# Altium project WiWi_SDR.PrjPcb (part 4 of 5)

## Sheet 14-DPLL_1.SchDoc
size C; SheetNumber: 14; SheetTotal: 19
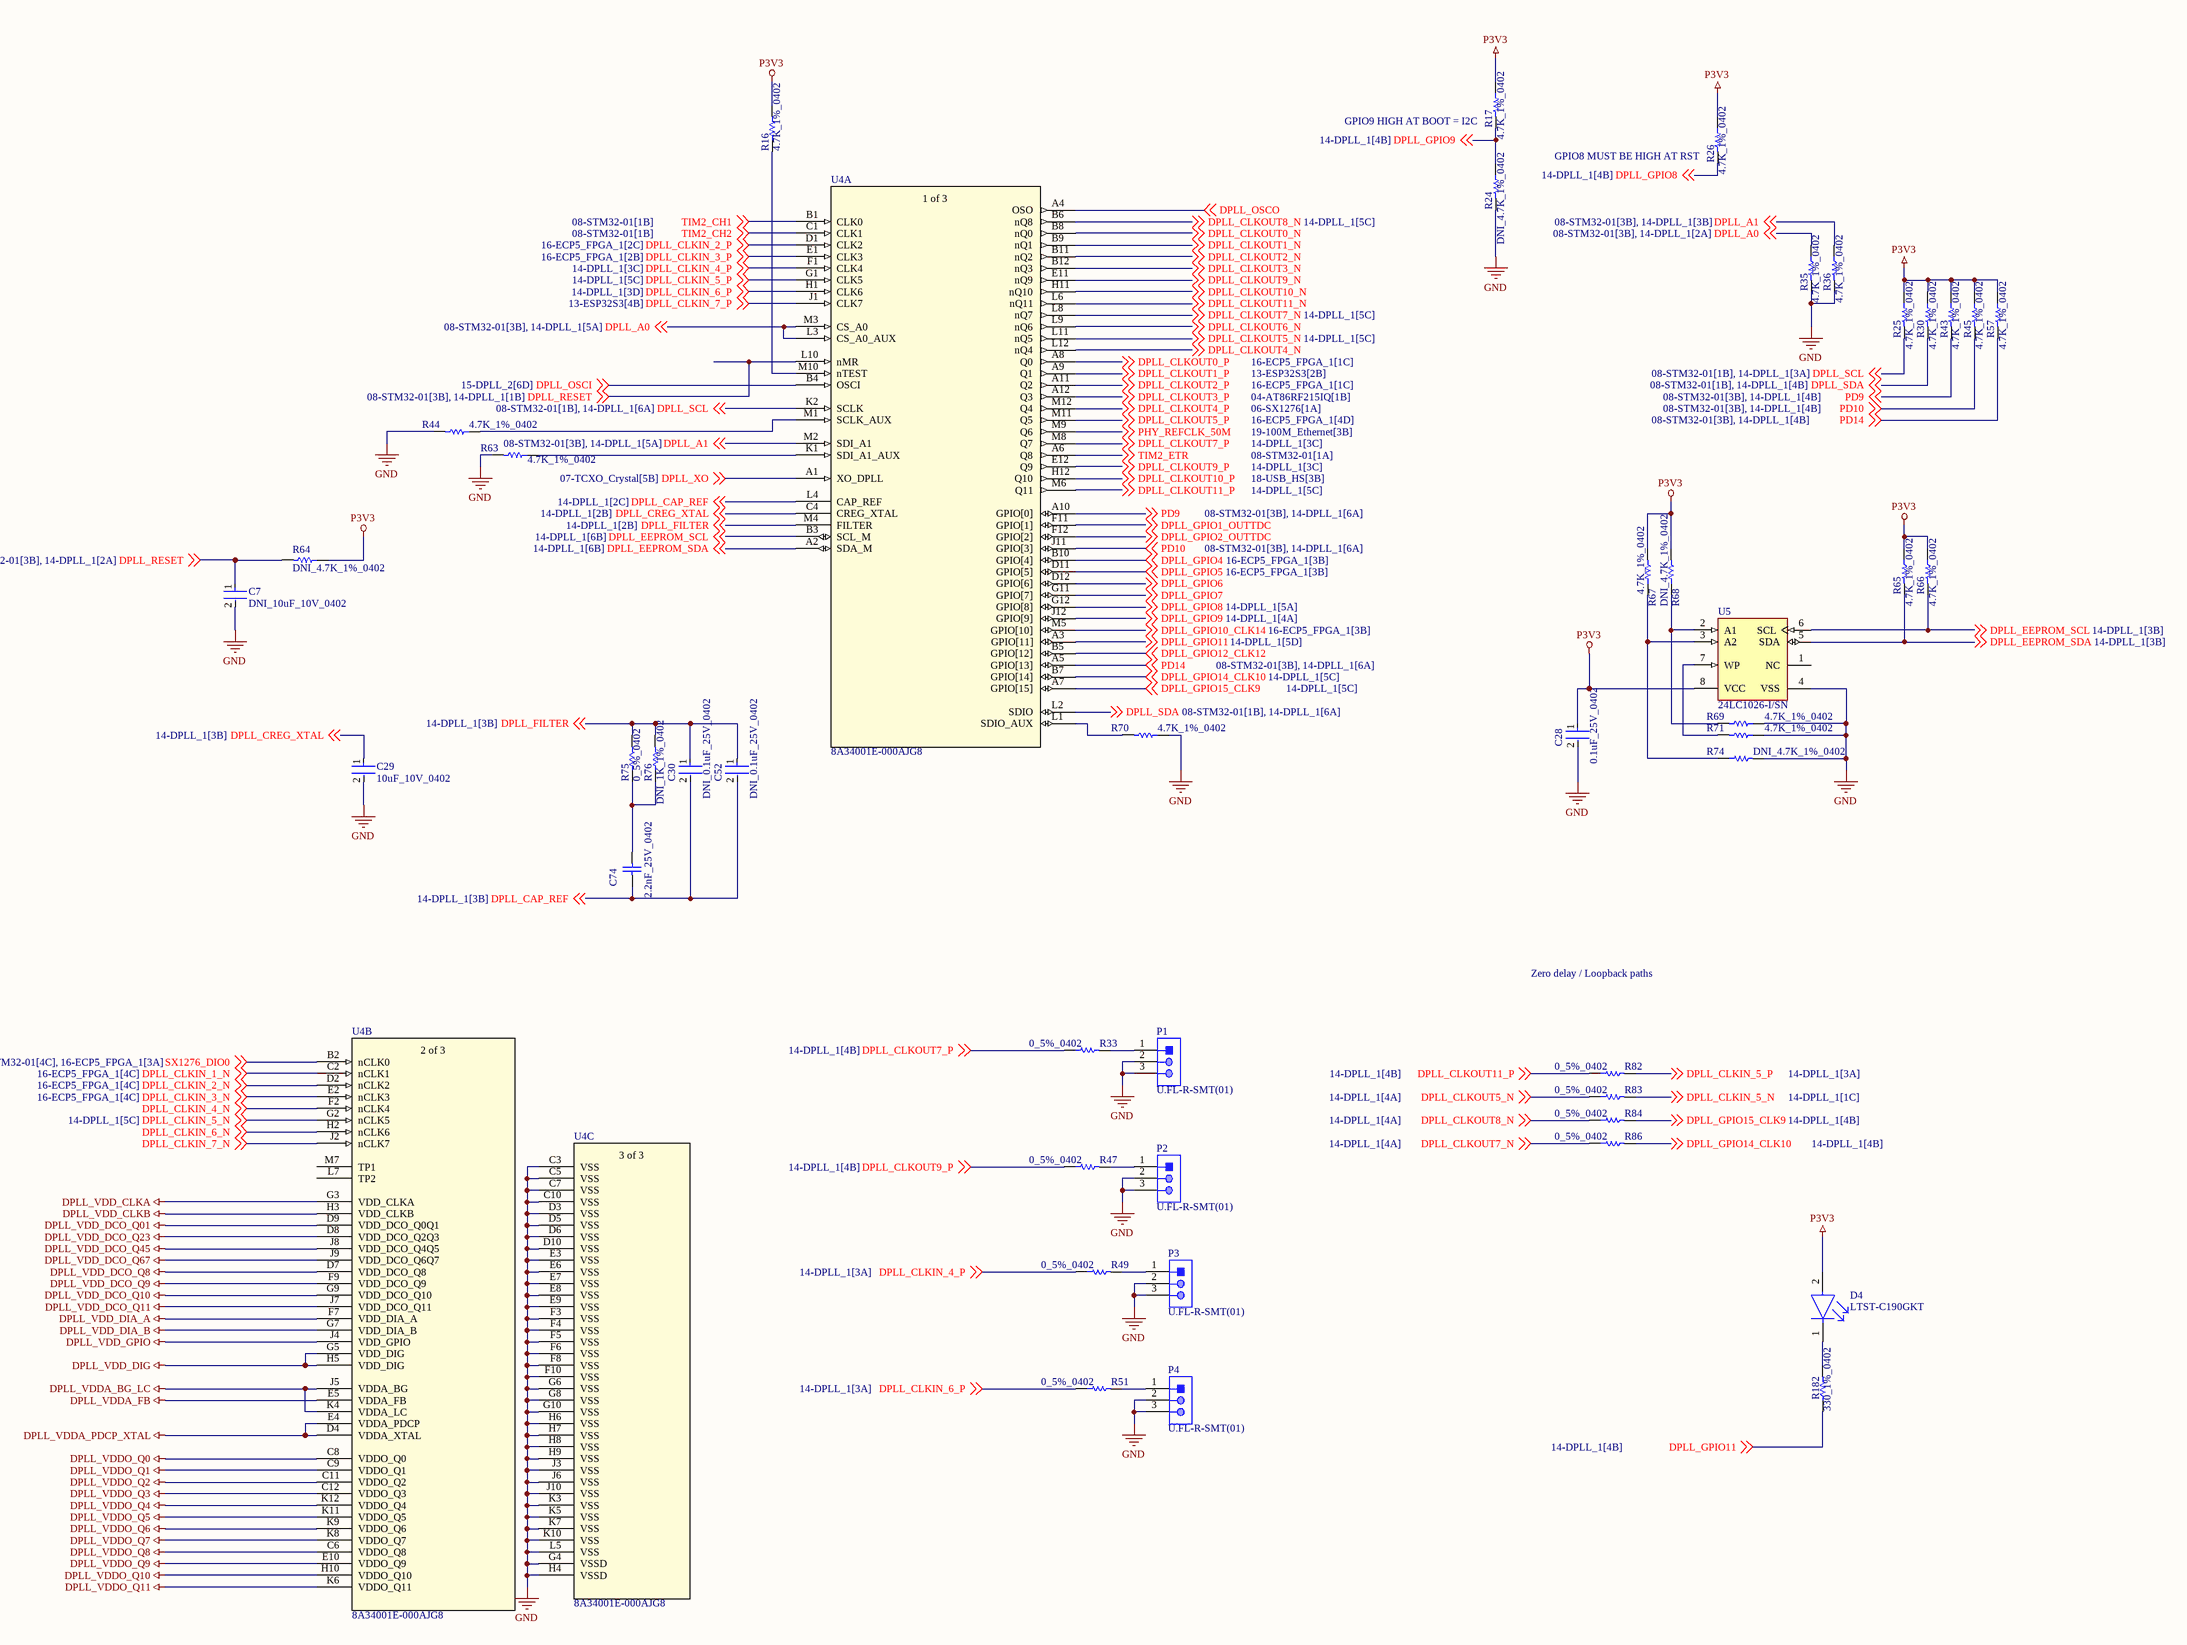
[diagram p11: 14-DPLL_1.SchDoc]

### Parts
C7  DNI_10uF_10V_0402  [FP-CL05A106MP5NUNC-MFG]  (no BOM)
C28  0.1uF_25V_0402  [FP-0402-L_1_0_1-W_0_5_0_1-IPC_C]
C29  10uF_10V_0402  [FP-CL05A106MP5NUNC-MFG]
C30  DNI_0.1uF_25V_0402  [FP-0402-L_1_0_1-W_0_5_0_1-IPC_C]  (no BOM)
C52  DNI_0.1uF_25V_0402  [FP-0402-L_1_0_1-W_0_5_0_1-IPC_C]  (no BOM)
C74  2.2nF_25V_0402  [CAPC1005X56X25LL10T15]
D4  LTST-C190GKT  [FP-LTST-C190GKT-MFG]
P1  U.FL-R-SMT(01)  [HRS-U.FL-R-SMT(10)_V]
P2  U.FL-R-SMT(01)  [HRS-U.FL-R-SMT(10)_V]
P3  U.FL-R-SMT(01)  [HRS-U.FL-R-SMT(10)_V]
P4  U.FL-R-SMT(01)  [HRS-U.FL-R-SMT(10)_V]
R16  4.7K_1%_0402  [RESC1005X40X25NL10T10]
R17  4.7K_1%_0402  [RESC1005X40X25NL10T10]
R24  DNI_4.7K_1%_0402  [RESC1005X40X25NL10T10]  (no BOM)
R25  4.7K_1%_0402  [RESC1005X40X25NL10T10]
R26  4.7K_1%_0402  [RESC1005X40X25NL10T10]
R30  4.7K_1%_0402  [RESC1005X40X25NL10T10]
R33  0_5%_0402  [RESC1005X40X25LL10T10]
R35  4.7K_1%_0402  [RESC1005X40X25NL10T10]
R36  4.7K_1%_0402  [RESC1005X40X25NL10T10]
R43  4.7K_1%_0402  [RESC1005X40X25NL10T10]
R44  4.7K_1%_0402  [RESC1005X40X25NL10T10]
R45  4.7K_1%_0402  [RESC1005X40X25NL10T10]
R47  0_5%_0402  [RESC1005X40X25LL10T10]
R49  0_5%_0402  [RESC1005X40X25LL10T10]
R51  0_5%_0402  [RESC1005X40X25LL10T10]
R57  4.7K_1%_0402  [RESC1005X40X25NL10T10]
R63  4.7K_1%_0402  [RESC1005X40X25NL10T10]
R64  DNI_4.7K_1%_0402  [RESC1005X40X25NL10T10]  (no BOM)
R65  4.7K_1%_0402  [RESC1005X40X25NL10T10]
R66  4.7K_1%_0402  [RESC1005X40X25NL10T10]
R67  4.7K_1%_0402  [RESC1005X40X25NL10T10]
R68  DNI_4.7K_1%_0402  [RESC1005X40X25NL10T10]  (no BOM)
R69  4.7K_1%_0402  [RESC1005X40X25NL10T10]
R70  4.7K_1%_0402  [RESC1005X40X25NL10T10]
R71  4.7K_1%_0402  [RESC1005X40X25NL10T10]
R74  DNI_4.7K_1%_0402  [RESC1005X40X25NL10T10]  (no BOM)
R75  0_5%_0402  [RESC1005X40X25LL10T10]
R76  DNI_1K_1%_0402  [RESC1005X40X25NL05T05]  (no BOM)
R82  0_5%_0402  [RESC1005X40X25LL10T10]
R83  0_5%_0402  [RESC1005X40X25LL10T10]
R84  0_5%_0402  [RESC1005X40X25LL10T10]
R86  0_5%_0402  [RESC1005X40X25LL10T10]
R182  330_1%_0402  [RESC1005X40X25NL10T10]
U4  8A34001E-000AJG8  [144-CABGA_REN]  (parts A,B,C of 3)
U5  24LC1026-I/SN  [MCHP-SOIC-SN8_N]

### Nets
DPLL_VDD_CLKA: U4.G3(VDD_CLKA)
DPLL_VDD_CLKB: U4.H3(VDD_CLKB)
DPLL_VDD_DCO_Q01: U4.D9(VDD_DCO_Q0Q1)
DPLL_VDD_DCO_Q8: U4.D7(VDD_DCO_Q8)
DPLL_VDD_DCO_Q9: U4.F9(VDD_DCO_Q9)
DPLL_VDD_DCO_Q10: U4.G9(VDD_DCO_Q10)
DPLL_VDD_DCO_Q11: U4.J7(VDD_DCO_Q11)
DPLL_VDD_DCO_Q23: U4.D8(VDD_DCO_Q2Q3)
DPLL_VDD_DCO_Q45: U4.J8(VDD_DCO_Q4Q5)
DPLL_VDD_DCO_Q67: U4.J9(VDD_DCO_Q6Q7)
DPLL_VDD_DIA_A: U4.F7(VDD_DIA_A)
DPLL_VDD_DIA_B: U4.G7(VDD_DIA_B)
DPLL_VDD_DIG: U4.G5(VDD_DIG) U4.H5(VDD_DIG)
DPLL_VDD_GPIO: U4.J4(VDD_GPIO)
DPLL_VDDA_BG_LC: U4.J5(VDDA_BG) U4.K4(VDDA_LC)
DPLL_VDDA_FB: U4.E5(VDDA_FB)
DPLL_VDDA_PDCP_XTAL: U4.D4(VDDA_XTAL) U4.E4(VDDA_PDCP)
DPLL_VDDO_Q0: U4.C8(VDDO_Q0)
DPLL_VDDO_Q1: U4.C9(VDDO_Q1)
DPLL_VDDO_Q2: U4.C11(VDDO_Q2)
DPLL_VDDO_Q3: U4.C12(VDDO_Q3)
DPLL_VDDO_Q4: U4.K12(VDDO_Q4)
DPLL_VDDO_Q5: U4.K11(VDDO_Q5)
DPLL_VDDO_Q6: U4.K9(VDDO_Q6)
DPLL_VDDO_Q7: U4.K8(VDDO_Q7)
DPLL_VDDO_Q8: U4.C6(VDDO_Q8)
DPLL_VDDO_Q9: U4.E10(VDDO_Q9)
DPLL_VDDO_Q10: U4.H10(VDDO_Q10)
DPLL_VDDO_Q11: U4.K6(VDDO_Q11)
GND: C7.2 C28.2 C29.2 P1.2 P1.3 P2.2 P2.3 P3.2 P3.3 P4.2 P4.3 R24.2 R35.2 R36.2 R44.2 R63.2 R69.1 R70.1 R71.1 R74.2 U4.C3(VSS) U4.C5(VSS) U4.C7(VSS) U4.C10(VSS) U4.D3(VSS) U4.D5(VSS) U4.D6(VSS) U4.D10(VSS) U4.E3(VSS) U4.E6(VSS) U4.E7(VSS) U4.E8(VSS) U4.E9(VSS) U4.F3(VSS) U4.F4(VSS) U4.F5(VSS) U4.F6(VSS) U4.F8(VSS) U4.F10(VSS) U4.G4(VSSD) U4.G6(VSS) U4.G8(VSS) U4.G10(VSS) U4.H4(VSSD) U4.H6(VSS) U4.H7(VSS) U4.H8(VSS) U4.H9(VSS) U4.J3(VSS) U4.J6(VSS) U4.J10(VSS) U4.K3(VSS) U4.K5(VSS) U4.K7(VSS) U4.K10(VSS) U4.L5(VSS) U5.4(VSS)
P3V3: C28.1 D4.2(A) R16.2 R17.1 R25.1 R26.1 R30.1 R43.1 R45.1 R57.1 R64.1 R65.1 R66.1 R67.2 R68.2 U5.8(VCC)
DPLL_A0: R35.1 U4.L3(CS_A0_AUX) U4.M3(CS_A0) ; off-sheet DPLL_A0
DPLL_A1: R36.1 U4.M2(SDI_A1) ; off-sheet DPLL_A1
DPLL_CAP_REF: C30.2 C52.2 C74.1 U4.L4(CAP_REF) ; off-sheet DPLL_CAP_REF
DPLL_CLKIN_1_N: U4.C2(nCLK1) ; off-sheet DPLL_CLKIN_1_N
DPLL_CLKIN_2_N: U4.D2(nCLK2) ; off-sheet DPLL_CLKIN_2_N
DPLL_CLKIN_2_P: U4.D1(CLK2) ; off-sheet DPLL_CLKIN_2_P
DPLL_CLKIN_3_N: U4.E2(nCLK3) ; off-sheet DPLL_CLKIN_3_N
DPLL_CLKIN_3_P: U4.E1(CLK3) ; off-sheet DPLL_CLKIN_3_P
DPLL_CLKIN_4_N: U4.F2(nCLK4) ; off-sheet DPLL_CLKIN_4_N
DPLL_CLKIN_4_P: R49.1 U4.F1(CLK4) ; off-sheet DPLL_CLKIN_4_P
DPLL_CLKIN_5_N: R83.2 U4.G2(nCLK5) ; off-sheet DPLL_CLKIN_5_N
DPLL_CLKIN_5_P: R82.2 U4.G1(CLK5) ; off-sheet DPLL_CLKIN_5_P
DPLL_CLKIN_6_N: U4.H2(nCLK6) ; off-sheet DPLL_CLKIN_6_N
DPLL_CLKIN_6_P: R51.1 U4.H1(CLK6) ; off-sheet DPLL_CLKIN_6_P
DPLL_CLKIN_7_N: U4.J2(nCLK7) ; off-sheet DPLL_CLKIN_7_N
DPLL_CLKIN_7_P: U4.J1(CLK7) ; off-sheet DPLL_CLKIN_7_P
DPLL_CLKOUT0_N: U4.B8(nQ0) ; off-sheet DPLL_CLKOUT0_N
DPLL_CLKOUT0_P: U4.A8(Q0) ; off-sheet DPLL_CLKOUT0_P
DPLL_CLKOUT1_N: U4.B9(nQ1) ; off-sheet DPLL_CLKOUT1_N
DPLL_CLKOUT1_P: U4.A9(Q1) ; off-sheet DPLL_CLKOUT1_P
DPLL_CLKOUT2_N: U4.B11(nQ2) ; off-sheet DPLL_CLKOUT2_N
DPLL_CLKOUT2_P: U4.A11(Q2) ; off-sheet DPLL_CLKOUT2_P
DPLL_CLKOUT3_N: U4.B12(nQ3) ; off-sheet DPLL_CLKOUT3_N
DPLL_CLKOUT3_P: U4.A12(Q3) ; off-sheet DPLL_CLKOUT3_P
DPLL_CLKOUT4_N: U4.L12(nQ4) ; off-sheet DPLL_CLKOUT4_N
DPLL_CLKOUT4_P: U4.M12(Q4) ; off-sheet DPLL_CLKOUT4_P
DPLL_CLKOUT5_N: R83.1 U4.L11(nQ5) ; off-sheet DPLL_CLKOUT5_N
DPLL_CLKOUT5_P: U4.M11(Q5) ; off-sheet DPLL_CLKOUT5_P
DPLL_CLKOUT6_N: U4.L9(nQ6) ; off-sheet DPLL_CLKOUT6_N
DPLL_CLKOUT7_N: R86.1 U4.L8(nQ7) ; off-sheet DPLL_CLKOUT7_N
DPLL_CLKOUT7_P: R33.1 U4.M8(Q7) ; off-sheet DPLL_CLKOUT7_P
DPLL_CLKOUT8_N: R84.1 U4.B6(nQ8) ; off-sheet DPLL_CLKOUT8_N
DPLL_CLKOUT9_N: U4.E11(nQ9) ; off-sheet DPLL_CLKOUT9_N
DPLL_CLKOUT9_P: R47.1 U4.E12(Q9) ; off-sheet DPLL_CLKOUT9_P
DPLL_CLKOUT10_N: U4.H11(nQ10) ; off-sheet DPLL_CLKOUT10_N
DPLL_CLKOUT10_P: U4.H12(Q10) ; off-sheet DPLL_CLKOUT10_P
DPLL_CLKOUT11_N: U4.L6(nQ11) ; off-sheet DPLL_CLKOUT11_N
DPLL_CLKOUT11_P: R82.1 U4.M6(Q11) ; off-sheet DPLL_CLKOUT11_P
DPLL_CREG_XTAL: C29.1 U4.C4(CREG_XTAL) ; off-sheet DPLL_CREG_XTAL
DPLL_EEPROM_SCL: R66.2 U4.B3(SCL_M) U5.6(SCL) ; off-sheet DPLL_EEPROM_SCL
DPLL_EEPROM_SDA: R65.2 U4.A2(SDA_M) U5.5(SDA) ; off-sheet DPLL_EEPROM_SDA
DPLL_FILTER: C30.1 C52.1 R75.2 R76.2 U4.M4(FILTER) ; off-sheet DPLL_FILTER
DPLL_GPIO1_OUTTDC: U4.F11(GPIO[1]) ; off-sheet DPLL_GPIO1_OUTTDC
DPLL_GPIO2_OUTTDC: U4.F12(GPIO[2]) ; off-sheet DPLL_GPIO2_OUTTDC
DPLL_GPIO4: U4.B10(GPIO[4]) ; off-sheet DPLL_GPIO4
DPLL_GPIO5: U4.D11(GPIO[5]) ; off-sheet DPLL_GPIO5
DPLL_GPIO6: U4.D12(GPIO[6]) ; off-sheet DPLL_GPIO6
DPLL_GPIO7: U4.G11(GPIO[7]) ; off-sheet DPLL_GPIO7
DPLL_GPIO8: R26.2 U4.G12(GPIO[8]) ; off-sheet DPLL_GPIO8
DPLL_GPIO9: R17.2 R24.1 U4.J12(GPIO[9]) ; off-sheet DPLL_GPIO9
DPLL_GPIO10_CLK14: U4.M5(GPIO[10]) ; off-sheet DPLL_GPIO10_CLK14
DPLL_GPIO11: R182.1 U4.A3(GPIO[11]) ; off-sheet DPLL_GPIO11
DPLL_GPIO12_CLK12: U4.B5(GPIO[12]) ; off-sheet DPLL_GPIO12_CLK12
DPLL_GPIO14_CLK10: R86.2 U4.B7(GPIO[14]) ; off-sheet DPLL_GPIO14_CLK10
DPLL_GPIO15_CLK9: R84.2 U4.A7(GPIO[15]) ; off-sheet DPLL_GPIO15_CLK9
DPLL_OSCI: U4.B4(OSCI) ; off-sheet DPLL_OSCI
DPLL_OSCO: U4.A4(OSO) ; off-sheet DPLL_OSCO
DPLL_RESET: C7.1 R64.2 U4.L10(nMR) ; off-sheet DPLL_RESET
DPLL_SCL: R25.2 U4.K2(SCLK) ; off-sheet DPLL_SCL
DPLL_SDA: R30.2 U4.L2(SDIO) ; off-sheet DPLL_SDA
DPLL_XO: U4.A1(XO_DPLL) ; off-sheet DPLL_XO
PD9: R43.2 U4.A10(GPIO[0]) ; off-sheet PD9
PD10: R45.2 U4.J11(GPIO[3]) ; off-sheet PD10
PD14: R57.2 U4.A5(GPIO[13]) ; off-sheet PD14
PHY_REFCLK_50M: U4.M9(Q6) ; off-sheet PHY_REFCLK_50M
SX1276_DIO0: U4.B2(nCLK0) ; off-sheet SX1276_DIO0
TIM2_CH1: U4.B1(CLK0) ; off-sheet TIM2_CH1
TIM2_CH2: U4.C1(CLK1) ; off-sheet TIM2_CH2
TIM2_ETR: U4.A6(Q8) ; off-sheet TIM2_ETR
NetC74_2: C74.2 R75.1 R76.1
NetD4_1: D4.1(C) R182.2
NetP1_1: P1.1 R33.2
NetP2_1: P2.1 R47.2
NetP3_1: P3.1 R49.2
NetP4_1: P4.1 R51.2
NetR16_1: R16.1 U4.M10(nTEST)
NetR44_1: R44.1 U4.M1(SCLK_AUX)
NetR63_1: R63.1 U4.K1(SDI_A1_AUX)
NetR67_1: R67.1 R74.1 U5.3(A2)
NetR68_1: R68.1 R69.2 U5.2(A1)
NetR70_2: R70.2 U4.L1(SDIO_AUX)
NetR71_2: R71.2 U5.7(WP)

Not connected (* = marked no-connect by the designer): U4 L7(TP2) M7(TP1); U5 1(NC)

### Notes on the sheet
- (near R17) GPIO9 HIGH AT BOOT = I2C
- (near R26) GPIO8 MUST BE HIGH AT RST
- Zero delay / Loopback paths
- (in symbol 8A34001E-000AJG8, part A) 1 of 3
- (in symbol 8A34001E-000AJG8, part B) 2 of 3
- (in symbol 8A34001E-000AJG8, part C) 3 of 3

### Library data of the parts
C7 C29 = CMP-13271-000002-1: CAP CER 10UF 10V X5R 0402; Manufacturer Part Number: CL05A106MP5NUNC; Manufacturer: Samsung; Temperature Coefficient: 15%; Tolerance: 20%; Material: Ceramic; Octopart: https://octopart.com/cl05a106mp5nunc-samsung-22457395; Voltage Rating: 10V; RoHS: TRUE; Value: 10uF; Height: 0.7mm; Digikey Description: CAP CER 10UF 10V X5R 0402; Automotive: No; Package: CL05A106MP5NUNC; Device Class L1: Passive Components; Capacitance: 10uF; Temperature Range High: +85°C; ComponentLink2Description: Datasheet; Device Class L2: Capacitors; Temperature Characteristic: X5R; Temperature: -55°C to +85°C; ComponentLink2URL: http://www.samsungsem.com/kr/support/product-search/mlcc/__icsFiles/afieldfile/2019/05/10/19-CL05A106MP5NUNC.pdf; Device Class L3: Ceramic Capacitors; Category: Cap; Temperature Range Low: -55°C; Ipc Land Pattern Name: CAPC10050X50; Lead Free: Yes
C28 C30 C52 = CMP-2008-02519-2: General Purpose Ceramic Capacitor, 0402, 100nF, 10%, X7R, 15%, 25V; Package Quantity: 1; Capacitance: 100nF; Min Operating Temperature: -55°C; Voltage: 25V; Voltage Rating: 25V; Construction: Flat; Max Operating Temperature: 125°C; Radiation Hardening: No; Depth: 0.5mm; Thickness: 0.022inch; Voltage Rating (DC): 25V; Number of Pins: 2; Lead Free: Lead Free; Series: -; REACH SVHC: No SVHC; Length: 1mm; Dielectric: X7R; RoHS Compliant: Yes; Mount: Surface Mount; Packaging: Tape and Reel; Case/Package: 0402; Case Code (Imperial): 0402; Termination: SMD/SMT; Width: 0.02inch; Case Code (Metric): 1005; Tolerance: 10%
C74 = CMP-2008-02907-1: Manufacturer: AVX Interconnect / Elco; Part Number: 04025C222JAT2A
D4 = CMP-22017-000005-2: LED GREEN CLEAR CHIP SMD; Dominant Wavelength: 569nm; Reverse Voltage: 5V; Lens Color: Colorless; Viewing Angle: 130°; Voltage: 2V; Forward Current: 30mA; Power Dissipation: 100mW; Luminous Intensity: 6mcd; Number of LEDs: 1; Forward Voltage: 2.1V; Wavelength: 565nm; Test Current: 10mA; Min Operating Temperature: -55°C; Lens Style: Clear; Mount: Surface Mount; Width: 0.8mm; Packaging: Tape and Reel; Lens Transparency: Clear; Case Code (Metric): 1608; Depth: 0.8mm; Case Code (Imperial): 0603; Case/Package: 0603; Number of Pins: 2; Max Operating Temperature: 85°C; Lead Free: Lead Free; Number of Elements: 1; Length: 1.6mm; Height: 0.8mm; Package Quantity: 1; Power Rating: 100mW; Radiation Hardening: No; Illumination Color: Green; Color: Green
P1-P4 = CMP-2000-05151-1: CONN RECPT ULTRA-MINI COAX SMD; Manufacturer: Hirose Electric; Centre Contact Resistance: 25mohm; Voltage Rating V AC: 60V; Female Contact Material: PhosphorBronze; Contact Resistance: 10mohm; Male Contact Material: Brass; Connector Type: UFLCoaxial; Connector Mounting: PCB; Impedance: 50ohm; Insulation Resistance: 500Mohm; Secondary Insulation Material: PBT; Frequency Max: 6GHz; Body Plating: Silver; External Length / Height: 2.5mm; Approval Category: UL94V-0; Female Contact Plating: Gold; Connector Mounting Orientation: PCBoard; VSWR: 1.3; Coaxial Termination: Solder; Body Style: StraightJack; SVHC: NoSVHC(18-Jun-2012); Jacket Material: LCP; Package Reference: U.FL-R-SMT(10); Datasheet Version: Feb-04; Outer Contact Resistance: 10mohm; Contact Plating: Gold; Mounting Type: PCBoard; Flammability Rating: UL94V-0; Operating Frequency Max: 6GHz; Termination Method: Solder; Male Contact Plating: Gold; Package Description: 3-Pin Surface Mount Device, Body 2.6 x 2.6 mm; Operating Temperature Min: -40degC; Manufacturer URL: https://www.hirose.com; Operating Temperature Max: 90degC; Contact Material: PhosphorBronze; Datasheet URL: http://www.farnell.com/datasheets/91524.pdf; Material: PhosphorBronze
R16 R17 R24-R26 R30 R35 R36 R43-R45 R57 R63-R71 R74 = CMP-2002-05217-1: Manufacturer: Bourns; Part Number: CR0402-FX-4701GLF
R33 R47 R49 R51 R75 R82-R84 R86 = CMP-2002-04569-1: Manufacturer: KOA Speer; Part Number: RK73Z1ETTP
R76 = CMP-2002-08277-1: Manufacturer: Vishay Dale; Part Number: CRCW04021K00FKTD
R182 = CMP-2002-05853-1: Manufacturer: Panasonic; Part Number: ERA-2AED331X
U4 = 8A34001E-000AJG8: No Description Available; Mfr_Name: Renesas Electronics; Copyright: Copyright (C) 2024 Ultra Librarian. All rights reserved.; Manufacturer_Part_Number: 8A34001E-000AJG8; RefDes: RefDes; Type: DEV
U5 = CMP-0159-01024-1: 1024K bits I2C™ Serial EEPROM, 2.5 to 5.5 V, 400 kHz, -40 to 85 degC, 8-pin SOIC (SN8), Tube; Manufacturer: Microchip; DatasheetVersion: Rev. C; ComponentLink3Description: Package Specification; ComponentLink1URL: http://www.microchip.com; Mounting Technology: Surface Mount; ComponentLink4URL: http://www.microchip.com/24LC1026; ComponentLink2Description: Datasheet; PartNumber: 24LC1026-I/SN; PackageReference: SOIC-SN8; PackageDescription: 8-Lead Plastic Small Outline, 4.9 x 3.9 mm Body, 1.27 mm Pitch; ComponentLink1Description: Manufacturer URL; ComponentLink3URL: http://www.microchip.com/stellent/groups/techpub_sg/documents/packagingspec/en012702.pdf; ComponentLink2URL: http://ww1.microchip.com/downloads/en/DeviceDoc/22270C.pdf; PackageVersion: C04-057C; ComponentLink4Description: Product URL

## Sheet 16-ECP5_FPGA_1.SchDoc
size B; SheetNumber: 16; SheetTotal: 19
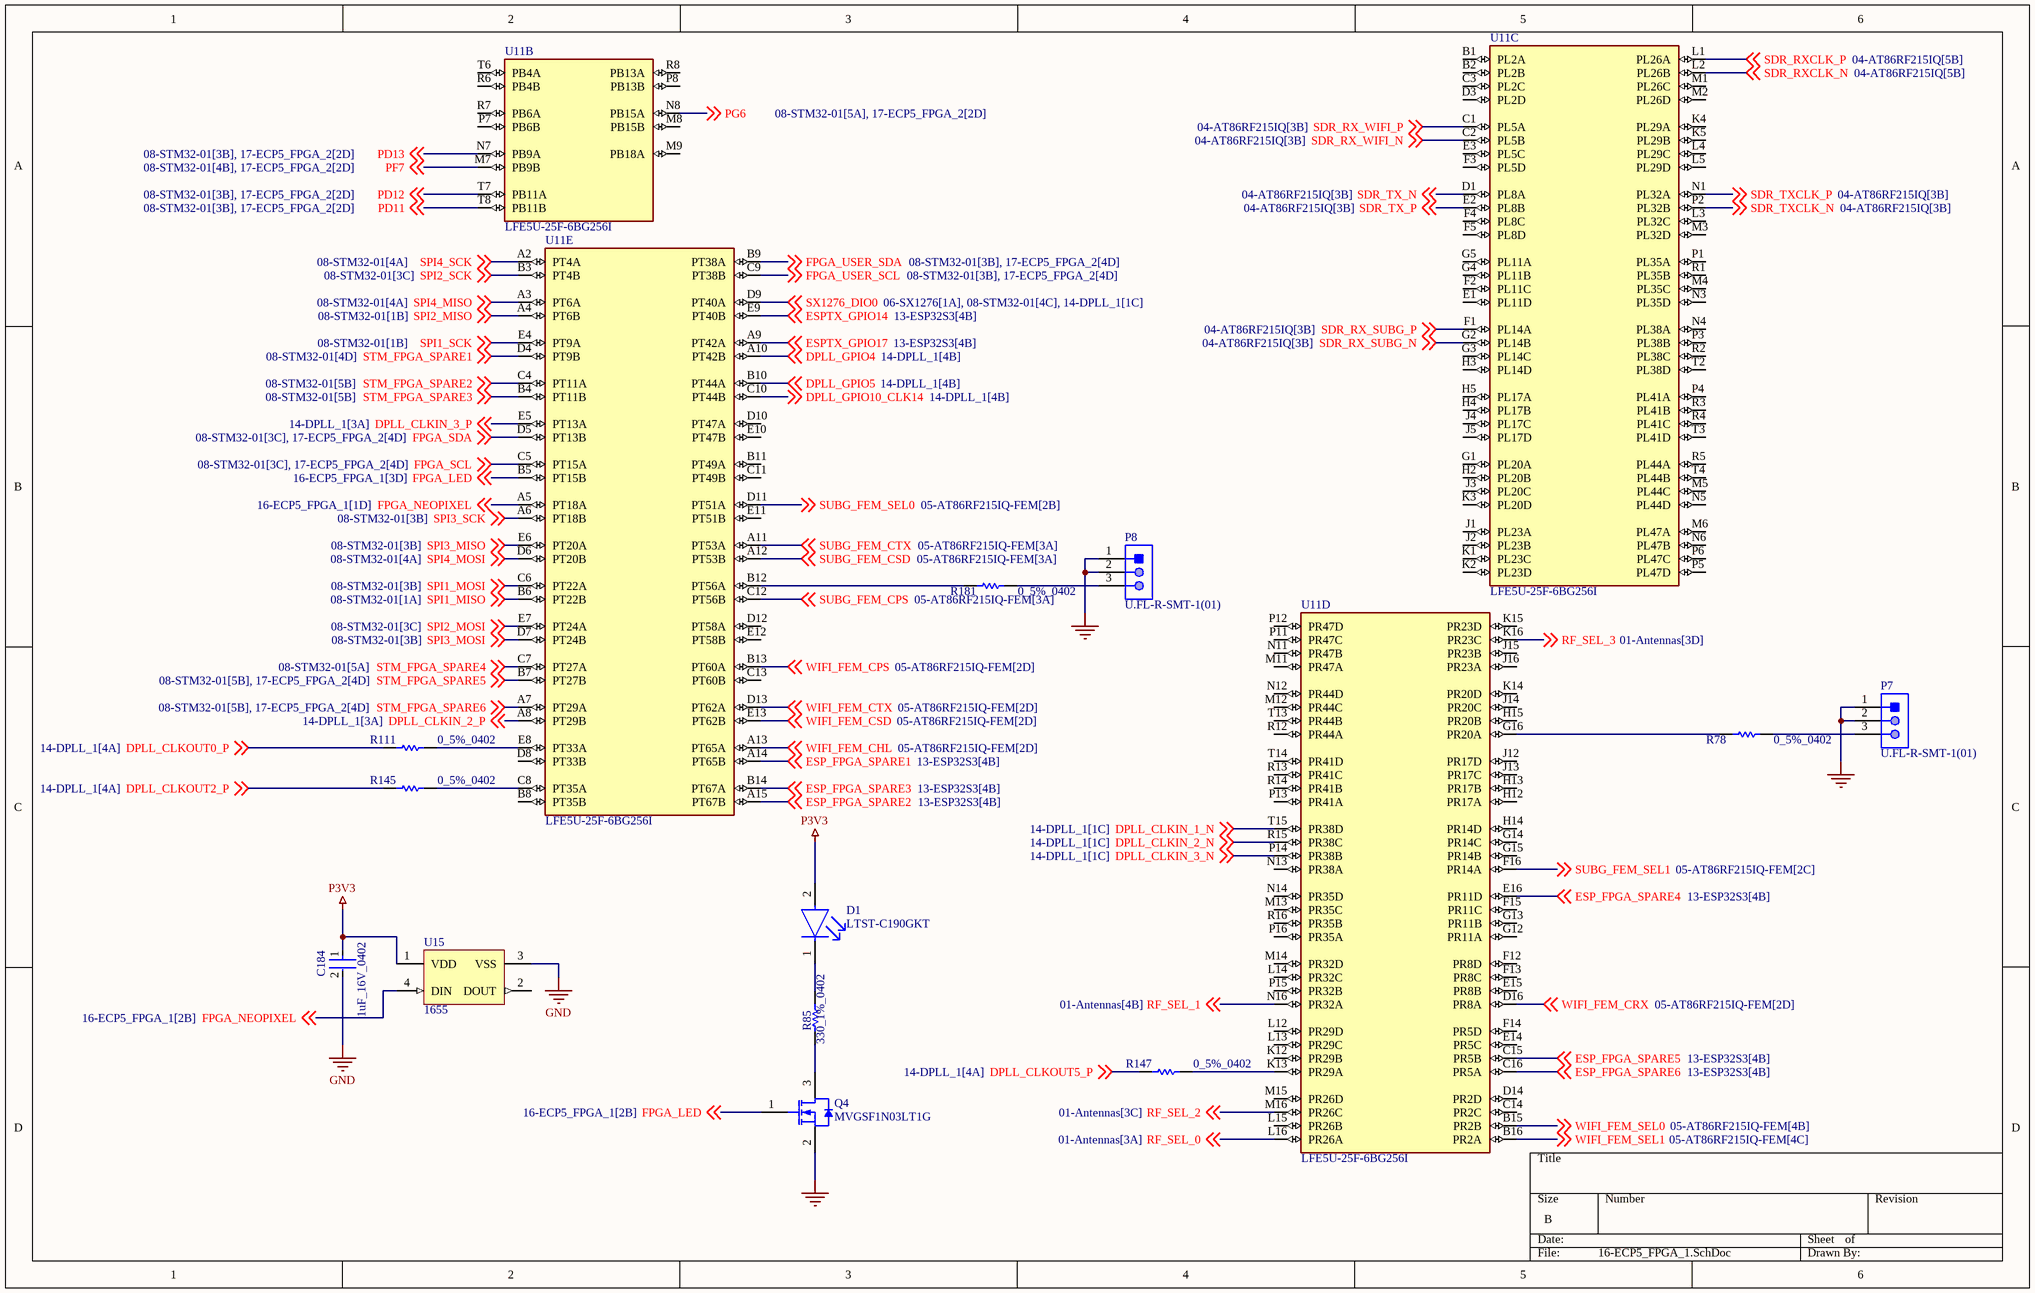
[diagram p12: 16-ECP5_FPGA_1.SchDoc]

### Parts
C184  1uF_16V_0402  [FP-0402-L_1_0_0_05-W_0_5-IPC_A]
D1  LTST-C190GKT  [FP-LTST-C190GKT-MFG]
P7  U.FL-R-SMT-1(01)  [HRS-U.FL-R-SMT-3_V]
P8  U.FL-R-SMT-1(01)  [HRS-U.FL-R-SMT-3_V]
Q4  MVGSF1N03LT1G  [ONSC-SOT-23-3-318-08_V]
R78  0_5%_0402  [RESC1005X40X25NL05T10]
R85  330_1%_0402  [RESC1005X40X25NL10T10]
R111  0_5%_0402  [RESC1005X40X25NL05T10]
R145  0_5%_0402  [RESC1005X40X25NL05T10]
R147  0_5%_0402  [RESC1005X40X25NL05T10]
R181  0_5%_0402  [RESC1005X40X25NL05T10]
U11  LFE5U-25F-6BG256I  [FP-LFE5U-25F-6BG256I-MFG]  (parts B,C,D,E of 5)
U15  1655  [ADA-RGB-1655_V]

### Nets
GND: C184.2 P7.1 P7.2 P8.1 P8.2 Q4.2(S) U15.3(VSS)
P3V3: C184.1 D1.2(A) U15.1(VDD)
DPLL_CLKIN_1_N: U11.T15(PR38D) ; off-sheet DPLL_CLKIN_1_N
DPLL_CLKIN_2_N: U11.R15(PR38C) ; off-sheet DPLL_CLKIN_2_N
DPLL_CLKIN_2_P: U11.A8(PT29B) ; off-sheet DPLL_CLKIN_2_P
DPLL_CLKIN_3_N: U11.P14(PR38B) ; off-sheet DPLL_CLKIN_3_N
DPLL_CLKIN_3_P: U11.E5(PT13A) ; off-sheet DPLL_CLKIN_3_P
DPLL_CLKOUT0_P: R111.1 ; off-sheet DPLL_CLKOUT0_P
DPLL_CLKOUT2_P: R145.1 ; off-sheet DPLL_CLKOUT2_P
DPLL_CLKOUT5_P: R147.1 ; off-sheet DPLL_CLKOUT5_P
DPLL_GPIO4: U11.A10(PT42B) ; off-sheet DPLL_GPIO4
DPLL_GPIO5: U11.B10(PT44A) ; off-sheet DPLL_GPIO5
DPLL_GPIO10_CLK14: U11.C10(PT44B) ; off-sheet DPLL_GPIO10_CLK14
ESP_FPGA_SPARE1: U11.A14(PT65B) ; off-sheet ESP_FPGA_SPARE1
ESP_FPGA_SPARE2: U11.A15(PT67B) ; off-sheet ESP_FPGA_SPARE2
ESP_FPGA_SPARE3: U11.B14(PT67A) ; off-sheet ESP_FPGA_SPARE3
ESP_FPGA_SPARE4: U11.E16(PR11D) ; off-sheet ESP_FPGA_SPARE4
ESP_FPGA_SPARE5: U11.C15(PR5B) ; off-sheet ESP_FPGA_SPARE5
ESP_FPGA_SPARE6: U11.C16(PR5A) ; off-sheet ESP_FPGA_SPARE6
ESPTX_GPIO14: U11.E9(PT40B) ; off-sheet ESPTX_GPIO14
ESPTX_GPIO17: U11.A9(PT42A) ; off-sheet ESPTX_GPIO17
FPGA_LED: Q4.1(G) U11.B5(PT15B) ; off-sheet FPGA_LED
FPGA_NEOPIXEL: U11.A5(PT18A) U15.4(DIN) ; off-sheet FPGA_NEOPIXEL
FPGA_SCL: U11.C5(PT15A) ; off-sheet FPGA_SCL
FPGA_SDA: U11.D5(PT13B) ; off-sheet FPGA_SDA
FPGA_USER_SCL: U11.C9(PT38B) ; off-sheet FPGA_USER_SCL
FPGA_USER_SDA: U11.B9(PT38A) ; off-sheet FPGA_USER_SDA
PD11: U11.T8(PB11B) ; off-sheet PD11
PD12: U11.T7(PB11A) ; off-sheet PD12
PD13: U11.N7(PB9A) ; off-sheet PD13
PF7: U11.M7(PB9B) ; off-sheet PF7
PG6: U11.N8(PB15A) ; off-sheet PG6
RF_SEL_0: U11.L16(PR26A) ; off-sheet RF_SEL_0
RF_SEL_1: U11.N16(PR32A) ; off-sheet RF_SEL_1
RF_SEL_2: U11.M16(PR26C) ; off-sheet RF_SEL_2
RF_SEL_3: U11.K16(PR23C) ; off-sheet RF_SEL_3
SDR_RX_SUBG_N: U11.G2(PL14B) ; off-sheet SDR_RX_SUBG_N
SDR_RX_SUBG_P: U11.F1(PL14A) ; off-sheet SDR_RX_SUBG_P
SDR_RX_WIFI_N: U11.C2(PL5B) ; off-sheet SDR_RX_WIFI_N
SDR_RX_WIFI_P: U11.C1(PL5A) ; off-sheet SDR_RX_WIFI_P
SDR_RXCLK_N: U11.L2(PL26B) ; off-sheet SDR_RXCLK_N
SDR_RXCLK_P: U11.L1(PL26A) ; off-sheet SDR_RXCLK_P
SDR_TX_N: U11.D1(PL8A) ; off-sheet SDR_TX_N
SDR_TX_P: U11.E2(PL8B) ; off-sheet SDR_TX_P
SDR_TXCLK_N: U11.P2(PL32B) ; off-sheet SDR_TXCLK_N
SDR_TXCLK_P: U11.N1(PL32A) ; off-sheet SDR_TXCLK_P
SPI1_MISO: U11.B6(PT22B) ; off-sheet SPI1_MISO
SPI1_MOSI: U11.C6(PT22A) ; off-sheet SPI1_MOSI
SPI1_SCK: U11.E4(PT9A) ; off-sheet SPI1_SCK
SPI2_MISO: U11.A4(PT6B) ; off-sheet SPI2_MISO
SPI2_MOSI: U11.E7(PT24A) ; off-sheet SPI2_MOSI
SPI2_SCK: U11.B3(PT4B) ; off-sheet SPI2_SCK
SPI3_MISO: U11.E6(PT20A) ; off-sheet SPI3_MISO
SPI3_MOSI: U11.D7(PT24B) ; off-sheet SPI3_MOSI
SPI3_SCK: U11.A6(PT18B) ; off-sheet SPI3_SCK
SPI4_MISO: U11.A3(PT6A) ; off-sheet SPI4_MISO
SPI4_MOSI: U11.D6(PT20B) ; off-sheet SPI4_MOSI
SPI4_SCK: U11.A2(PT4A) ; off-sheet SPI4_SCK
STM_FPGA_SPARE1: U11.D4(PT9B) ; off-sheet STM_FPGA_SPARE1
STM_FPGA_SPARE2: U11.C4(PT11A) ; off-sheet STM_FPGA_SPARE2
STM_FPGA_SPARE3: U11.B4(PT11B) ; off-sheet STM_FPGA_SPARE3
STM_FPGA_SPARE4: U11.C7(PT27A) ; off-sheet STM_FPGA_SPARE4
STM_FPGA_SPARE5: U11.B7(PT27B) ; off-sheet STM_FPGA_SPARE5
STM_FPGA_SPARE6: U11.A7(PT29A) ; off-sheet STM_FPGA_SPARE6
SUBG_FEM_CPS: U11.C12(PT56B) ; off-sheet SUBG_FEM_CPS
SUBG_FEM_CSD: U11.A12(PT53B) ; off-sheet SUBG_FEM_CSD
SUBG_FEM_CTX: U11.A11(PT53A) ; off-sheet SUBG_FEM_CTX
SUBG_FEM_SEL0: U11.D11(PT51A) ; off-sheet SUBG_FEM_SEL0
SUBG_FEM_SEL1: U11.F16(PR14A) ; off-sheet SUBG_FEM_SEL1
SX1276_DIO0: U11.D9(PT40A) ; off-sheet SX1276_DIO0
WIFI_FEM_CHL: U11.A13(PT65A) ; off-sheet WIFI_FEM_CHL
WIFI_FEM_CPS: U11.B13(PT60A) ; off-sheet WIFI_FEM_CPS
WIFI_FEM_CRX: U11.D16(PR8A) ; off-sheet WIFI_FEM_CRX
WIFI_FEM_CSD: U11.E13(PT62B) ; off-sheet WIFI_FEM_CSD
WIFI_FEM_CTX: U11.D13(PT62A) ; off-sheet WIFI_FEM_CTX
WIFI_FEM_SEL0: U11.B15(PR2B) ; off-sheet WIFI_FEM_SEL0
WIFI_FEM_SEL1: U11.B16(PR2A) ; off-sheet WIFI_FEM_SEL1
NetD1_1: D1.1(C) R85.2
NetP7_3: P7.3 R78.2
NetP8_3: P8.3 R181.2
NetQ4_3: Q4.3(D) R85.1
NetR78_1: R78.1 U11.G16(PR20A)
NetR111_2: R111.2 U11.E8(PT33A)
NetR145_2: R145.2 U11.C8(PT35A)
NetR147_2: R147.2 U11.K13(PR29A)
NetR181_1: R181.1 U11.B12(PT56A)

Not connected (* = marked no-connect by the designer): U11 B1(PL2A) B2(PL2B) B8(PT35B) B11(PT49A) C3(PL2C) C11(PT49B) C13(PT60B) C14(PR2C) D3(PL2D) D8(PT33B) D10(PT47A) D12(PT58A) D14(PR2D) E1(PL11D) E3(PL5C) E10(PT47B) E11(PT51B) E12(PT58B) E14(PR5C) E15(PR8B) F2(PL11C) F3(PL5D) F4(PL8C) F5(PL8D) F12(PR8D) F13(PR8C) F14(PR5D) F15(PR11C) G1(PL20A) G3(PL14C) G4(PL11B) G5(PL11A) G12(PR11A) G13(PR11B) G14(PR14C) G15(PR14B) H2(PL20B) H3(PL14D) H4(PL17B) H5(PL17A) H12(PR17A) H13(PR17B) H14(PR14D) H15(PR20B) J1(PL23A) J2(PL23B) J3(PL20C) J4(PL17C) J5(PL17D) J12(PR17D) J13(PR17C) J14(PR20C) J15(PR23B) J16(PR23A) K1(PL23C) K2(PL23D) K3(PL20D) K4(PL29A) K5(PL29B) K12(PR29B) K14(PR20D) K15(PR23D) L3(PL32C) L4(PL29C) L5(PL29D) L12(PR29D) L13(PR29C) L14(PR32C) L15(PR26B) M1(PL26C) M2(PL26D) M3(PL32D) M4(PL35C) M5(PL44C) M6(PL47A) M8(PB15B) M9(PB18A) M11(PR47A) M12(PR44C) M13(PR35C) M14(PR32D) M15(PR26D) N3(PL35D) N4(PL38A) N5(PL44D) N6(PL47B) N11(PR47B) N12(PR44D) N13(PR38A) N14(PR35D) P1(PL35A) P3(PL38B) P4(PL41A) P5(PL47D) P6(PL47C) P7(PB6B) P8(PB13B) P11(PR47C) P12(PR47D) P13(PR41A) P15(PR32B) P16(PR35A) R1(PL35B) R2(PL38C) R3(PL41B) R4(PL41C) R5(PL44A) R6(PB4B) R7(PB6A) R8(PB13A) R12(PR44A) R13(PR41C) R14(PR41B) R16(PR35B) T2(PL38D) T3(PL41D) T4(PL44B) T6(PB4A) T13(PR44B) T14(PR41D); U15 2(DOUT)

### Library data of the parts
C184 = CMP-14477-000104-2: as C129 on sheet 11-Power; Packaging: Tape and Reel; Depth: 0.5mm; Mount: Surface Mount; Thickness: 0.022inch; Package Quantity: 1; Min Operating Temperature: -55°C; Series: M; Voltage Rating (DC): 16V; Termination: SMD/SMT; Case/Package: 0402; Number of Pins: 2; Case Code (Imperial): 0402; Length: 1mm; Halogen Free: Halogen Free; Case Code (Metric): 1005; Width: 0.02inch; RoHS Compliant: Yes; Radiation Hardening: No; Max Operating Temperature: 85°C; Height: 0.5mm; Construction: Flat
D1 = CMP-22017-000005-2: as D4 on sheet 14-DPLL_1; Min Operating Temperature: -55°C; Lens Style: Clear; Mount: Surface Mount; Width: 0.8mm; Packaging: Tape and Reel; Lens Transparency: Clear; Case Code (Metric): 1608; Depth: 0.8mm; Case Code (Imperial): 0603; Case/Package: 0603; Number of Pins: 2; Max Operating Temperature: 85°C; Lead Free: Lead Free; Number of Elements: 1; Length: 1.6mm; Height: 0.8mm; Package Quantity: 1; Power Rating: 100mW; Radiation Hardening: No; Illumination Color: Green; Color: Green
P7 P8 = CMP-2000-05153-1: Ultra Small Coaxial Connector, 6 GHz, -40 to 90 degC, 3-Pin SMD, RoHS, Bulk; Manufacturer: Hirose Electric; Connector Style: U.FL; Impedance: 50Ohm; Dielectric Material: LiquidCrystalPolymer(LCP); Minimum Quantity: UltraMiniatureCoaxial; Online Catalog: U.FLSeries; Featured Product: HiroseU.FLSeries; Frequency - Max: 6GHz; Other Names: H122041 / U.FL-R-SMT-1(01)-ND; Contact Termination: Solder; Body Material: PhosphorBronze; Connector Type: Jack,MalePin; Body Finish: Silver; Center Contact Plating: Gold; Manufacturer URL: https://www.hirose.com; Family: CoaxialConnectors(RF); Fastening Type: Snap-On; Unit PriceUSD: U.FL; Series: U.FL; Package Reference: U.FL-R-SMT; Packaging: Bulk; Standard Package: 100; Mounting Type: SurfaceMount; Quantity Available: Bulk; Housing Color: Silver; Package Description: 3-Pin Surface Mount Device, Body 2.6 x 2.6 mm; Category: Connectors,Interconnects; Operating Temperature: -40degC~90degC; Center Contact Material: PhosphorBronze; Dynamic Catalog: U.FLSeries; Datasheet URL: https://datasheet.ciiva.com/26945/getdatasheetpartid-475239-26945414.pdf; Datasheet Version: Feb-09; Shield Termination: Solder
Q4 = CMP-1058-00779-1: as Q1-Q3 on sheet 11-Power; ComponentLink3URL: http://www.onsemi.cn/pub_link/Collateral/318-08.PDF; Configuration: Single; PackageDescription: 3-Pin Small Outline Transistor, Body 2.92 x 1.3 mm, Pitch 0.95 mm; Packing: Tape and Reel; PartNumber: MVGSF1N03LT1G; ComponentLink2URL: http://www.onsemi.cn/pub_link/Collateral/MGSF1N03LT1-D.PDF; PackageVersion: Rev. AP, 11/2009; ComponentLink3Description: Package Specification; Package Type: SOT-23-3; ComponentLink1Description: Manufacturer URL; DatasheetVersion: Rev. 10; PackageReference: SOT-23-3-318-08; ComponentLink2Description: Datasheet; ComponentLink1URL: http://www.onsemi.com/; RoHS: Pb-Free; Mounting Technology: Surface Mount
R78 R111 R145 R147 R181 = CMP-2002-06457-1: as R79 on sheet 11-Power
R85 = CMP-2002-05853-1: as R182 on sheet 14-DPLL_1
U11 = CMP-17932-000009-1: IC FPGA 197 I/O 256CABGA; RAM Size: 1032192b; Number of Logic Elements/Cells: 24000; Number of Logic Blocks (LABs): 6000; Number of I/Os: 197; Number of Pins: 256; Mount: Surface Mount; Max Operating Temperature: 100°C; RoHS Compliant: Yes; Min Operating Temperature: -40°C
U15 = CMP-2000-05026-1: Intelligent Control LED Integrated Light Source, 3.5 to 5.3 V, -25 to 80 degC, 4-Pin SMD, RoHS, Tape and Reel; Manufacturer: Adafruit-Industries-LLC; Number of LEDs: 10; Configuration: Discrete; Utilized LED: WS2812(5050); Datasheet URL: http://datasheet.octopart.com/ADA1655-Adafruit-Industries-datasheet-32028139.pdf; Series: Neopixel; Interface: -; Package Description: 4-Pin Surface Mount Device, Body 5 x 5 mm; Color: Red,Green,Blue(RGB); Category: Optoelectronics; Controller Type: -; Package Reference: 1655; Manufacturer URL: https://www.adafruit.com/; Mounting Type: SurfaceMount; Datasheet Version: May-13; Size / Dimension: 5.00mmLx5.00mmW; Family: Addressable,Specialty

## Sheet 17-ECP5_FPGA_2.SchDoc
size B; SheetNumber: 17; SheetTotal: 19
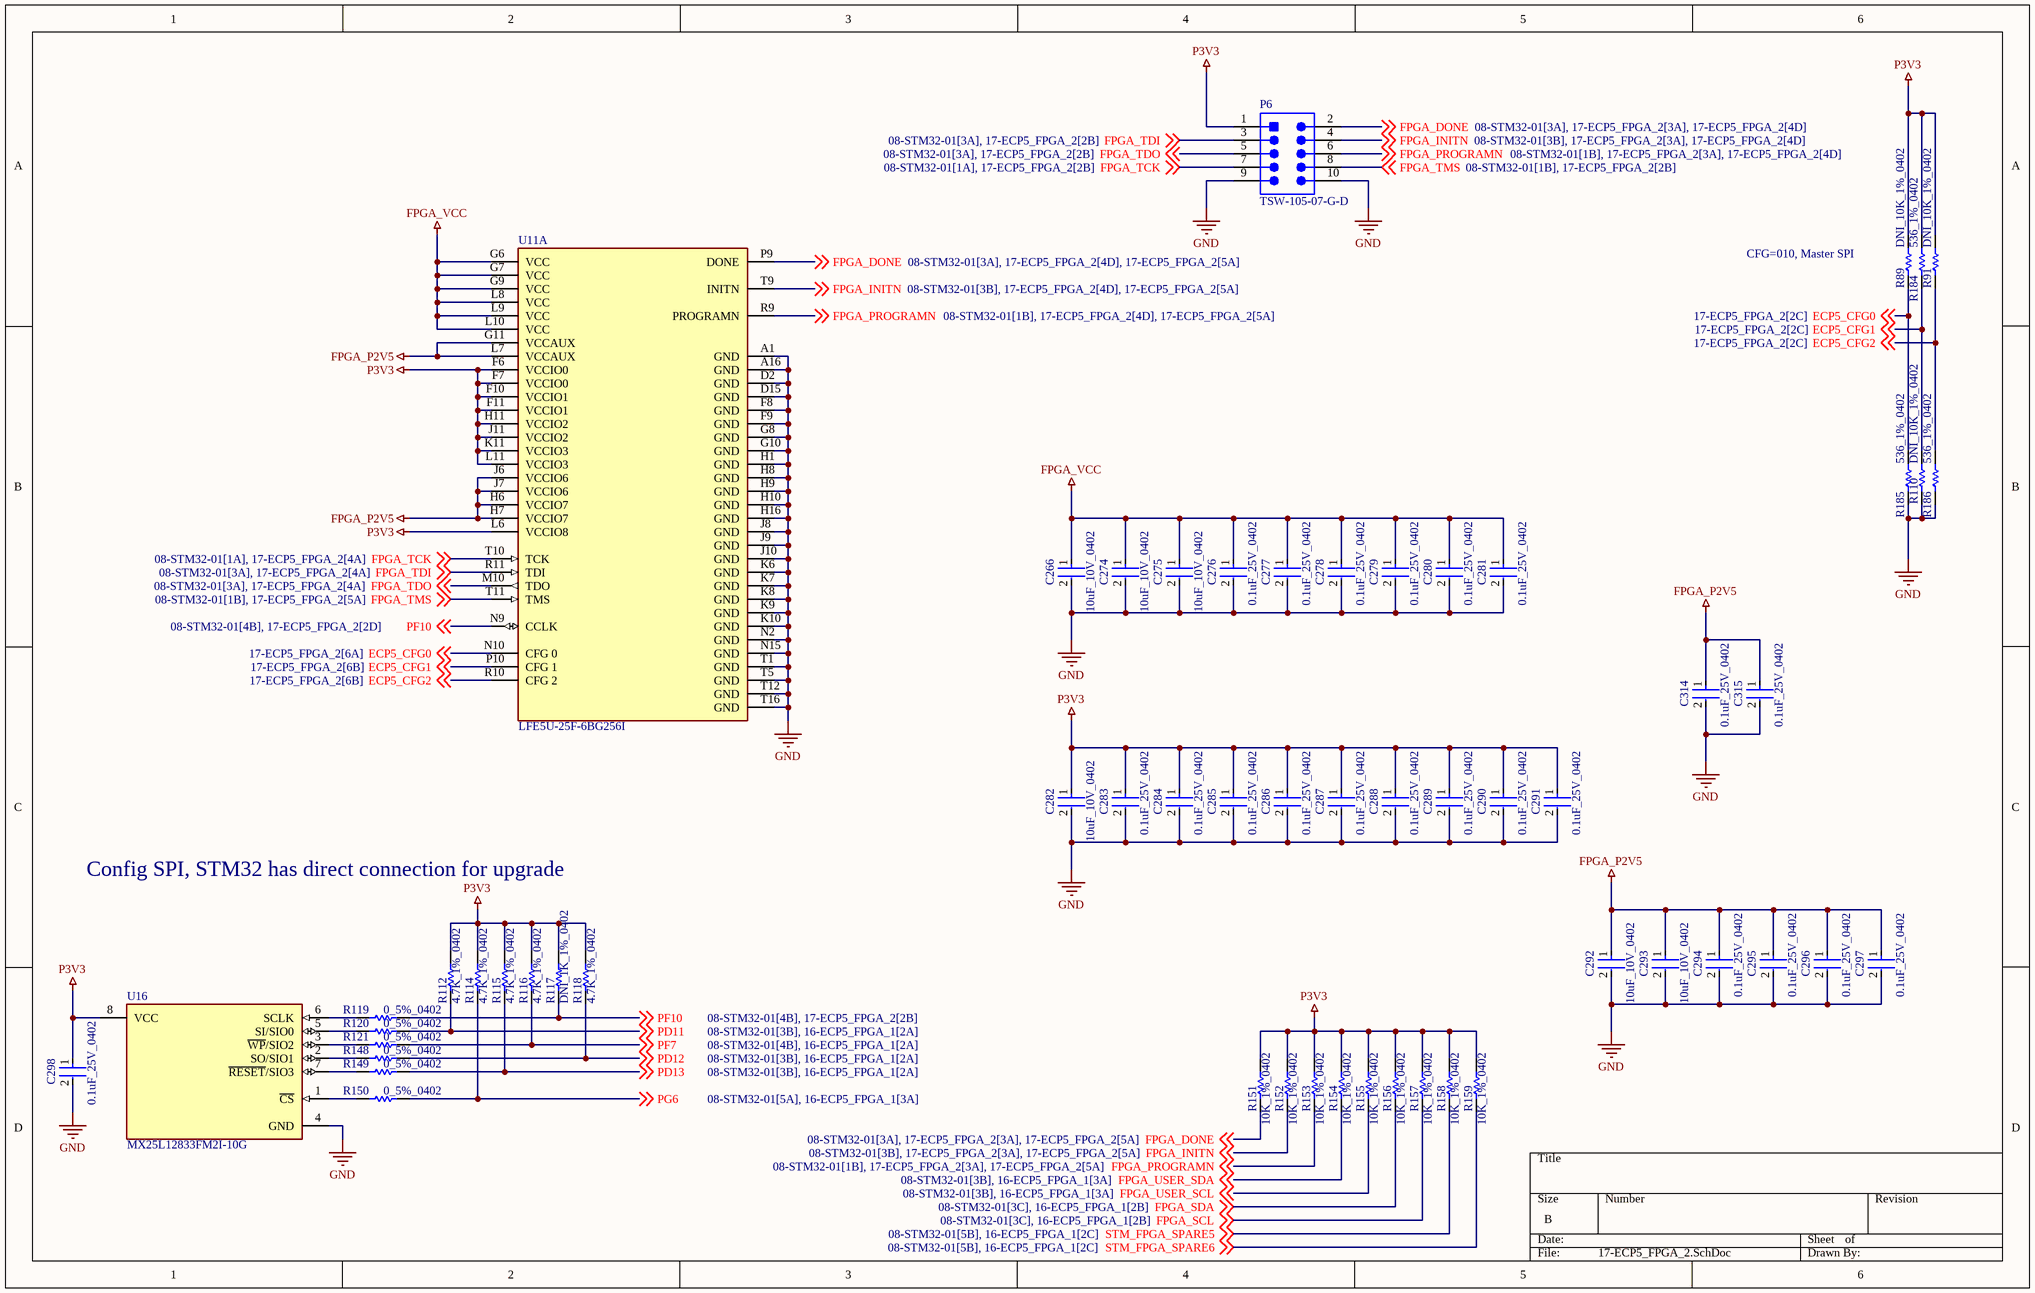
[diagram p13: 17-ECP5_FPGA_2.SchDoc]

### Parts
C266  10uF_10V_0402  [FP-CL05A106MP5NUNC-MFG]
C274  10uF_10V_0402  [FP-CL05A106MP5NUNC-MFG]
C275  10uF_10V_0402  [FP-CL05A106MP5NUNC-MFG]
C276  0.1uF_25V_0402  [FP-0402-L_1_0_1-W_0_5_0_1-IPC_C]
C277  0.1uF_25V_0402  [FP-0402-L_1_0_1-W_0_5_0_1-IPC_C]
C278  0.1uF_25V_0402  [FP-0402-L_1_0_1-W_0_5_0_1-IPC_C]
C279  0.1uF_25V_0402  [FP-0402-L_1_0_1-W_0_5_0_1-IPC_C]
C280  0.1uF_25V_0402  [FP-0402-L_1_0_1-W_0_5_0_1-IPC_C]
C281  0.1uF_25V_0402  [FP-0402-L_1_0_1-W_0_5_0_1-IPC_C]
C282  10uF_10V_0402  [FP-CL05A106MP5NUNC-MFG]
C283  0.1uF_25V_0402  [FP-0402-L_1_0_1-W_0_5_0_1-IPC_C]
C284  0.1uF_25V_0402  [FP-0402-L_1_0_1-W_0_5_0_1-IPC_C]
C285  0.1uF_25V_0402  [FP-0402-L_1_0_1-W_0_5_0_1-IPC_C]
C286  0.1uF_25V_0402  [FP-0402-L_1_0_1-W_0_5_0_1-IPC_C]
C287  0.1uF_25V_0402  [FP-0402-L_1_0_1-W_0_5_0_1-IPC_C]
C288  0.1uF_25V_0402  [FP-0402-L_1_0_1-W_0_5_0_1-IPC_C]
C289  0.1uF_25V_0402  [FP-0402-L_1_0_1-W_0_5_0_1-IPC_C]
C290  0.1uF_25V_0402  [FP-0402-L_1_0_1-W_0_5_0_1-IPC_C]
C291  0.1uF_25V_0402  [FP-0402-L_1_0_1-W_0_5_0_1-IPC_C]
C292  10uF_10V_0402  [FP-CL05A106MP5NUNC-MFG]
C293  10uF_10V_0402  [FP-CL05A106MP5NUNC-MFG]
C294  0.1uF_25V_0402  [FP-0402-L_1_0_1-W_0_5_0_1-IPC_C]
C295  0.1uF_25V_0402  [FP-0402-L_1_0_1-W_0_5_0_1-IPC_C]
C296  0.1uF_25V_0402  [FP-0402-L_1_0_1-W_0_5_0_1-IPC_C]
C297  0.1uF_25V_0402  [FP-0402-L_1_0_1-W_0_5_0_1-IPC_C]
C298  0.1uF_25V_0402  [FP-0402-L_1_0_1-W_0_5_0_1-IPC_C]
C314  0.1uF_25V_0402  [FP-0402-L_1_0_1-W_0_5_0_1-IPC_C]
C315  0.1uF_25V_0402  [FP-0402-L_1_0_1-W_0_5_0_1-IPC_C]
P6  TSW-105-07-G-D  [SMTC-TSW-105-07-G-D_V]
R89  DNI_10K_1%_0402  [RESC1005X40X25NL10T10]  (no BOM)
R91  DNI_10K_1%_0402  [RESC1005X40X25NL10T10]  (no BOM)
R110  DNI_10K_1%_0402  [RESC1005X40X25NL10T10]  (no BOM)
R112  4.7K_1%_0402  [RESC1005X40X25NL10T10]
R114  4.7K_1%_0402  [RESC1005X40X25NL10T10]
R115  4.7K_1%_0402  [RESC1005X40X25NL10T10]
R116  4.7K_1%_0402  [RESC1005X40X25NL10T10]
R117  DNI_1K_1%_0402  [RESC1005X40X25LL05T10]  (no BOM)
R118  4.7K_1%_0402  [RESC1005X40X25NL10T10]
R119  0_5%_0402  [RESC1005X40X25NL05T10]
R120  0_5%_0402  [RESC1005X40X25NL05T10]
R121  0_5%_0402  [RESC1005X40X25NL05T10]
R148  0_5%_0402  [RESC1005X40X25NL05T10]
R149  0_5%_0402  [RESC1005X40X25NL05T10]
R150  0_5%_0402  [RESC1005X40X25NL05T10]
R151  10K_1%_0402  [RESC1005X40X25NL10T10]
R152  10K_1%_0402  [RESC1005X40X25NL10T10]
R153  10K_1%_0402  [RESC1005X40X25NL10T10]
R154  10K_1%_0402  [RESC1005X40X25NL10T10]
R155  10K_1%_0402  [RESC1005X40X25NL10T10]
R156  10K_1%_0402  [RESC1005X40X25NL10T10]
R157  10K_1%_0402  [RESC1005X40X25NL10T10]
R158  10K_1%_0402  [RESC1005X40X25NL10T10]
R159  10K_1%_0402  [RESC1005X40X25NL10T10]
R184  536_1%_0402  [RESC1005X40X25NL05T05]
R185  536_1%_0402  [RESC1005X40X25NL05T05]
R186  536_1%_0402  [RESC1005X40X25NL05T05]
U11  LFE5U-25F-6BG256I  [FP-LFE5U-25F-6BG256I-MFG]  (part A of 5)
U16  MX25L12833FM2I-10G  [FP-MX25L12833FM2I-10G-MFG]

### Nets
FPGA_P2V5: C292.1 C293.1 C294.1 C295.1 C296.1 C297.1 C314.1 C315.1 U11.G11(VCCAUX) U11.H6(VCCIO7) U11.H7(VCCIO7) U11.J6(VCCIO6) U11.J7(VCCIO6) U11.L7(VCCAUX)
FPGA_VCC: C266.1 C274.1 C275.1 C276.1 C277.1 C278.1 C279.1 C280.1 C281.1 U11.G6(VCC) U11.G7(VCC) U11.G9(VCC) U11.L8(VCC) U11.L9(VCC) U11.L10(VCC)
GND: C266.2 C274.2 C275.2 C276.2 C277.2 C278.2 C279.2 C280.2 C281.2 C282.2 C283.2 C284.2 C285.2 C286.2 C287.2 C288.2 C289.2 C290.2 C291.2 C292.2 C293.2 C294.2 C295.2 C296.2 C297.2 C298.2 C314.2 C315.2 P6.9 P6.10 R110.1 R185.1 R186.1 U11.A1(GND) U11.A16(GND) U11.D2(GND) U11.D15(GND) U11.F8(GND) U11.F9(GND) U11.G8(GND) U11.G10(GND) U11.H1(GND) U11.H8(GND) U11.H9(GND) U11.H10(GND) U11.H16(GND) U11.J8(GND) U11.J9(GND) U11.J10(GND) U11.K6(GND) U11.K7(GND) U11.K8(GND) U11.K9(GND) U11.K10(GND) U11.N2(GND) U11.N15(GND) U11.T1(GND) U11.T5(GND) U11.T12(GND) U11.T16(GND) U16.4(GND)
P3V3: C282.1 C283.1 C284.1 C285.1 C286.1 C287.1 C288.1 C289.1 C290.1 C291.1 C298.1 P6.1 R89.2 R91.2 R112.2 R114.2 R115.2 R116.2 R117.2 R118.2 R151.2 R152.2 R153.2 R154.2 R155.2 R156.2 R157.2 R158.2 R159.2 R184.2 U11.F6(VCCIO0) U11.F7(VCCIO0) U11.F10(VCCIO1) U11.F11(VCCIO1) U11.H11(VCCIO2) U11.J11(VCCIO2) U11.K11(VCCIO3) U11.L6(VCCIO8) U11.L11(VCCIO3) U16.8(VCC)
ECP5_CFG0: R89.1 R185.2 U11.N10(CFG_0) ; off-sheet ECP5_CFG0
ECP5_CFG1: R110.2 R184.1 U11.P10(CFG_1) ; off-sheet ECP5_CFG1
ECP5_CFG2: R91.1 R186.2 U11.R10(CFG_2) ; off-sheet ECP5_CFG2
FPGA_DONE: P6.2 R151.1 U11.P9(DONE) ; off-sheet FPGA_DONE
FPGA_INITN: P6.4 R152.1 U11.T9(INITN) ; off-sheet FPGA_INITN
FPGA_PROGRAMN: P6.6 R153.1 U11.R9(PROGRAMN) ; off-sheet FPGA_PROGRAMN
FPGA_SCL: R157.1 ; off-sheet FPGA_SCL
FPGA_SDA: R156.1 ; off-sheet FPGA_SDA
FPGA_TCK: P6.7 U11.T10(TCK) ; off-sheet FPGA_TCK
FPGA_TDI: P6.3 U11.R11(TDI) ; off-sheet FPGA_TDI
FPGA_TDO: P6.5 U11.M10(TDO) ; off-sheet FPGA_TDO
FPGA_TMS: P6.8 U11.T11(TMS) ; off-sheet FPGA_TMS
FPGA_USER_SCL: R155.1 ; off-sheet FPGA_USER_SCL
FPGA_USER_SDA: R154.1 ; off-sheet FPGA_USER_SDA
PD11: R112.1 R120.2 ; off-sheet PD11
PD12: R118.1 R148.2 ; off-sheet PD12
PD13: R115.1 R149.2 ; off-sheet PD13
PF7: R116.1 R121.2 ; off-sheet PF7
PF10: R117.1 R119.2 U11.N9(CCLK) ; off-sheet PF10
PG6: R114.1 R150.2 ; off-sheet PG6
STM_FPGA_SPARE5: R158.1 ; off-sheet STM_FPGA_SPARE5
STM_FPGA_SPARE6: R159.1 ; off-sheet STM_FPGA_SPARE6
NetR119_1: R119.1 U16.6(SCLK)
NetR120_1: R120.1 U16.5(SI/SIO0)
NetR121_1: R121.1 U16.3(~{WP}/SIO2)
NetR148_1: R148.1 U16.2(SO/SIO1)
NetR149_1: R149.1 U16.7(~{RESET}/SIO3)
NetR150_1: R150.1 U16.1(~{CS})

### Notes on the sheet
- CFG=010, Master SPI
- Config SPI, STM32 has direct connection for upgrade

### Library data of the parts
C266 C274 C275 C282 C292 C293 = CMP-13271-000002-1: as C7 on sheet 14-DPLL_1; Octopart: https://octopart.com/cl05a106mp5nunc-samsung-22457395; Voltage Rating: 10V; RoHS: TRUE; Value: 10uF; Height: 0.7mm; Digikey Description: CAP CER 10UF 10V X5R 0402; Automotive: No; Package: CL05A106MP5NUNC; Device Class L1: Passive Components; Capacitance: 10uF; Temperature Range High: +85°C; ComponentLink2Description: Datasheet; Device Class L2: Capacitors; Temperature Characteristic: X5R; Temperature: -55°C to +85°C; ComponentLink2URL: http://www.samsungsem.com/kr/support/product-search/mlcc/__icsFiles/afieldfile/2019/05/10/19-CL05A106MP5NUNC.pdf; Device Class L3: Ceramic Capacitors; Category: Cap; Temperature Range Low: -55°C; Ipc Land Pattern Name: CAPC10050X50; Lead Free: Yes
C276-C281 C283-C291 C294-C298 C314 C315 = CMP-2008-02519-2: as C28 on sheet 14-DPLL_1; Package Quantity: 1; Capacitance: 100nF; Min Operating Temperature: -55°C; Voltage: 25V; Voltage Rating: 25V; Construction: Flat; Max Operating Temperature: 125°C; Radiation Hardening: No; Depth: 0.5mm; Thickness: 0.022inch; Voltage Rating (DC): 25V; Number of Pins: 2; Lead Free: Lead Free; Series: -; REACH SVHC: No SVHC; Length: 1mm; Dielectric: X7R; RoHS Compliant: Yes; Mount: Surface Mount; Packaging: Tape and Reel; Case/Package: 0402; Case Code (Imperial): 0402; Termination: SMD/SMT; Width: 0.02inch; Case Code (Metric): 1005; Tolerance: 10%
P6 = CMP-2000-07330-1: Post Terminal Strip Assembly, Pitch 2.54 mm, 2 x 5 Position, Height 8.58 mm, Tail Length 2.54 mm, -55 to 125 degC, RoHS, Bulk; Manufacturer: Samtec-Inc.; Connector Type: Header,Unshrouded; Number of Positions Loaded: All; Pitch: 0.100"(2.54mm); Number of Positions: 10; Package Reference: TSW-105-07-G-D; Mounting Technology: ThroughHole; Datasheet URL: http://suddendocs.samtec.com/prints/tsw-xxx-xx-xxx-x-xx-xxx-mkt.pdf; Termination: Solder; Packaging: Bulk; Number of Rows: 2; Contact Finish: Gold; Mounting Type: ThroughHole; Features: -; Color: Black; Category: Connectors,Interconnects; Family: RectangularConnectors-Headers,MalePins; Manufacturer URL: http://www.samtec.com/; Series: TSW; Fastening Type: -; Package URL: http://suddendocs.samtec.com/prints/tsw-xxx-xx-x-x-xx-xxx-footprint.pdf; Row Spacing: 0.100"(2.54mm); Contact Mating Length: 0.230"(5.84mm); Contact Finish Thickness: 10µin(0.25µm); Contact Type: MalePin; Package Description: Male Header, Pitch 2.54 mm, 2 x 5 Position, Height 8.58 mm, Tail Length 2.54 mm; Datasheet Version: Rev. DO, 08/1988
R89 R91 R110 R151-R159 = CMP-2002-04694-1: as R53 on sheet 11-Power
R112 R114-R116 R118 = CMP-2002-05217-1: as R16 on sheet 14-DPLL_1
R117 = CMP-2002-03045-1: Part Number: CRCW04021K00FKEDHP; Manufacturer: Vishay Dale
R119-R121 R148-R150 = CMP-2002-06457-1: as R79 on sheet 11-Power
R184-R186 = CMP-1011-00480-2: Manufacturer: Panasonic; Part Number: ERJ-2RKF5360X
U11 = CMP-17932-000009-1: as U11 on sheet 16-ECP5_FPGA_1; Number of Pins: 256; Mount: Surface Mount; Max Operating Temperature: 100°C; RoHS Compliant: Yes; Min Operating Temperature: -40°C
U16 = CMP-105207-000006-1: IC FLASH 128MBIT SPI/QUAD 8SOP; RoHS Compliant: Yes

## Sheet 18-USB_HS.SchDoc
size B; SheetNumber: 17; SheetTotal: 18
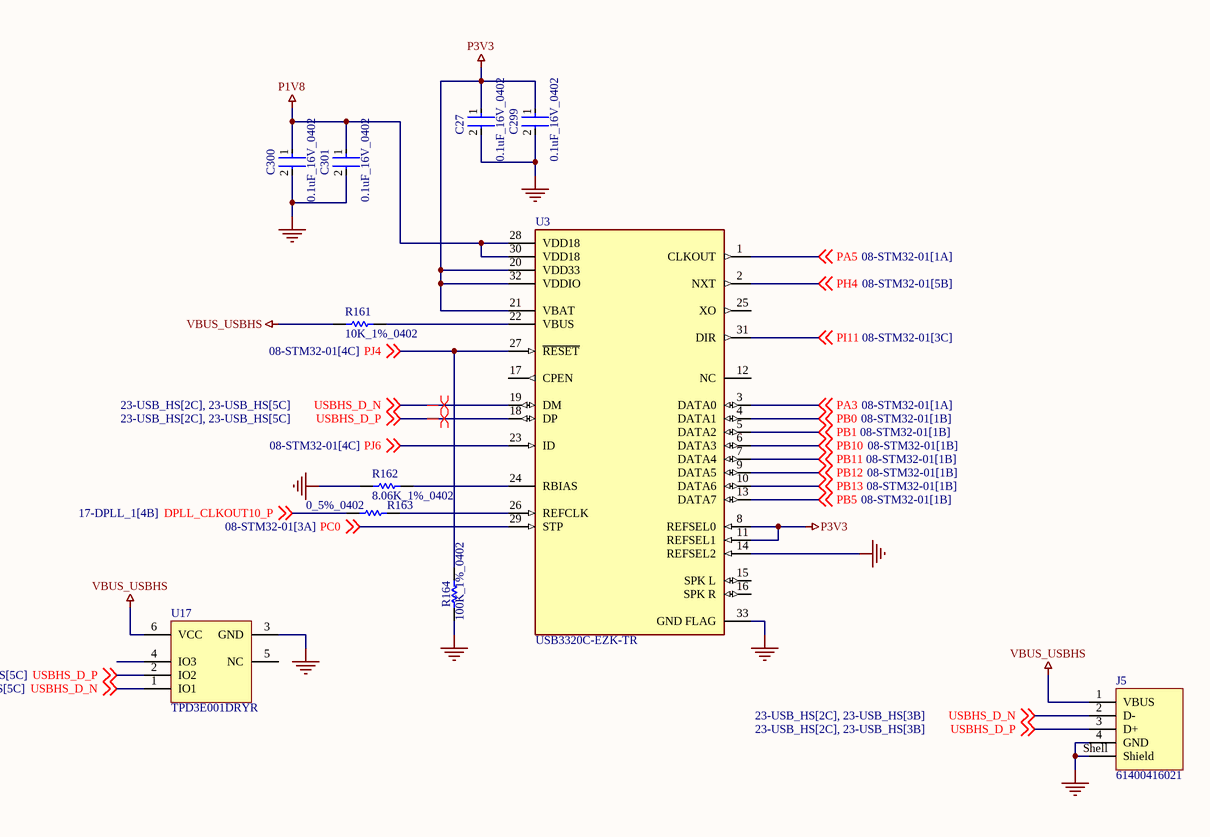
[diagram p14: 18-USB_HS.SchDoc]

### Parts
C27  0.1uF_16V_0402  [FP-C0402-BB-MFG]
C299  0.1uF_16V_0402  [FP-C0402-BB-MFG]
C300  0.1uF_16V_0402  [FP-C0402-BB-MFG]
C301  0.1uF_16V_0402  [FP-C0402-BB-MFG]
J5  61400416021  [61400416021]
R161  10K_1%_0402  [RESC1005X40X25NL10T10]
R162  8.06K_1%_0402  [RESC1005X40X25LL05T05]
R163  0_5%_0402  [RESC1005X40X25LL10T10]
R164  100K_1%_0402  [RESC1005X40X25ML05T10]
U3  USB3320C-EZK-TR  [FP-32QFN-3304-5X5B-MFG]
U17  TPD3E001DRYR  [DRY0006A]

### Nets
GND: C27.2 C299.2 C300.2 C301.2 J5.4(GND) J5.Shell(Shield) R162.1 R164.1 U3.14(REFSEL2) U3.33(GND_FLAG) U17.3(GND)
P1V8: C300.1 C301.1 U3.28(VDD18) U3.30(VDD18)
P3V3: C27.1 C299.1 U3.8(REFSEL0) U3.11(REFSEL1) U3.20(VDD33) U3.21(VBAT) U3.32(VDDIO)
VBUS_USBHS: J5.1(VBUS) R161.2 U17.6(VCC)
DPLL_CLKOUT10_P: R163.1 ; off-sheet DPLL_CLKOUT10_P
PA3: U3.3(DATA0) ; off-sheet PA3
PA5: U3.1(CLKOUT) ; off-sheet PA5
PB0: U3.4(DATA1) ; off-sheet PB0
PB1: U3.5(DATA2) ; off-sheet PB1
PB5: U3.13(DATA7) ; off-sheet PB5
PB10: U3.6(DATA3) ; off-sheet PB10
PB11: U3.7(DATA4) ; off-sheet PB11
PB12: U3.9(DATA5) ; off-sheet PB12
PB13: U3.10(DATA6) ; off-sheet PB13
PC0: U3.29(STP) ; off-sheet PC0
PH4: U3.2(NXT) ; off-sheet PH4
PI11: U3.31(DIR) ; off-sheet PI11
PJ4: R164.2 U3.27(~{RESET}) ; off-sheet PJ4
PJ6: U3.23(ID) ; off-sheet PJ6
USBHS_D_N: J5.2(D-) U3.19(DM) U17.1(IO1) ; off-sheet USBHS_D_N
USBHS_D_P: J5.3(D+) U3.18(DP) U17.2(IO2) ; off-sheet USBHS_D_P
NetR161_1: R161.1 U3.22(VBUS)
NetR162_2: R162.2 U3.24(RBIAS)
NetR163_2: R163.2 U3.26(REFCLK)

Not connected (* = marked no-connect by the designer): U3 12(NC) 15(SPK_L) 16(SPK_R) 17(CPEN) 25(XO); U17 4(IO3) 5(NC)

### Layout directives
differential pair: USBHS_D_N, USBHS_D_P

### Library data of the parts
C27 C299-C301 = CMP-1034-02068-3: as C35 on sheet 11-Power; ComponentLink2URL: https://content.kemet.com/datasheets/KEM_C1002_X7R_SMD.pdf; Automotive: No; Device Class L2: Capacitors; Temperature: -55°C to +125°C; RoHS: TRUE; Voltage Rating: 16 V; ComponentLink2Description: Datasheet; Device Class L3: Ceramic Capacitors; Temperature Range Low: -55°C; Ipc Land Pattern Name: CAPC10050X50; Device Class L1: Passive Components; Temperature Range High: +125°C; Package: C0402-BB; Capacitance: 0.10 μF; Category: Cap; Mouser Description: CAP CER 0.1UF 16V X7R 0402; Height: 0.55mm; Digikey Description: CAP CER 0.1UF 16V 5% X7R 0402; Octopart: https://octopart.com/c0402c104j4ractu-kemet-12573893; Temperature Characteristic: X7R; Lead Free: Yes
J5 = CMP-1502-03227-2: NexarPartId: 21041530; Contact Resistance: 20mΩ; Gender: Receptacle; Voltage Rating (DC): 30V; Current Rating: 1.5A; Connector Type: USB; Insulation Resistance: 1GΩ; USB Standard: USB 2.0; Number of Contacts: 4; Number of Ports: 1; Width: 14.4mm; REACH SVHC: Unknown; Contact Plating: Gold; Length: 15.8mm; Lead Free: Lead Free; Max Operating Temperature: 105°C; Orientation: Horizontal; Contact Material: Copper; Voltage Rating: 30V; Min Operating Temperature: -40°C; Flammability Rating: UL94 V-0; Color: White; RoHS: Compliant; Number of Pins: 4; Mount: Horizontal, Through Hole; Number of Positions: 4; Operating Supply Voltage: 30V; Insulation Material: PBT; Termination: Solder
R161 = CMP-2002-04694-1: as R53 on sheet 11-Power
R162 = CMP-1011-00612-2: Manufacturer: Panasonic; Part Number: ERJ-2RKF8061X
R163 = CMP-2002-04569-1: as R33 on sheet 14-DPLL_1
R164 = CMP-2002-07852-1: Manufacturer: Yageo; Part Number: RC0402FR-13100KL
U3 = CMP-0186-00336-2: IC TRANSCEIVER HALF 1/1 32QFN; Manufacturer: Microchip; Min Supply Voltage: 1.6V; Usb Standard: USB 2.0; Max Supply Voltage: 5.5V; Nominal Supply Current: 0.7-29400uA; Number Of Ports: 1; Interface: UART,USB; Standoff Height: 0mm; Digikey Description: IC TRANSCEIVER HALF 1/1 32QFN; Category: IC; Mouser Description: Microchip USB3320C-EZK-TR, USB Transceiver, USB 2.0, 1.8 V, 3.3 V, 32-Pin QFN; Ipc Land Pattern Name: QFN50P500X500X85-32; ComponentLink2Description: Datasheet; Device Class L2: Interface ICs; Temperature Range Low: -40°C; Ambient Temperature Range Low: -40°C; ComponentLink2URL: http://ww1.microchip.com/downloads/en/DeviceDoc/00001792E.pdf; Device Class L3: USB Interface ICs; Lead Free: Yes; RoHS: TRUE; Height: 1mm; Temperature Range High: +85°C; Octopart: https://octopart.com/usb3320c-ezk-tr-microchip-24995468; Device Class L1: Integrated Circuits (ICs); Automotive: No; Temperature: -40°C to +85°C; Ambient Temperature Range High: +85°C; Package: 32QFN-3304-5X5B; Manufacturer Part Number: USB3320C-EZK-TR
U17 = CMP-0326-00032-3: Low-Capacitance + / - 15 kV ESD-Protection Array for High-Speed Data Interfaces, 3 Channels, -40 to +85 degC, 6-pin SON (DRY), Green (RoHS & no Sb/Br); Manufacturer: Texas Instruments; USB High Speed: TRUE; SubFamily: ESD Solution; IO Capacitance(Typ)(pF): 1.5; IEC 61000-4-2 Contact(+/- kV): 8; IO Leakage Current(nA): Jan-00; Breakdown Voltage(Min)(V): 11; IEC 61000-4-2 Air-Gap(+/- kV): 15; DatasheetVersion: SLLS683D; Mounting Technology: Surface Mount; ComponentLink1URL: http://www.ti.com/; PackageReference: DRY0006A; ComponentLink2URL: http://www.ti.com/general/docs/lit/getliterature.tsp?genericPartNumber=TPD3E001&fileType=pdf; ComponentLink2Description: Datasheet; ComponentLink3Description: URL Link1; PackageDescription: 6-Pin Plastic Small Outline No-Lead, 1 x 1.45 x 0.6 mm Body, 0.5 mm Pitch; ComponentLink1Description: Manufacturer URL; PackageVersion: revF, Dec-2011; PartNumber: TPD3E001DRYR; Eco-Plan: Green (RoHS & no Sb/Br); ComponentLink3URL: SamplesURL:http://www.ti.com/product/tpd3e001#samples

## Sheet 19-100M_Ethernet.SchDoc
size B; SheetNumber: 18; SheetTotal: 18
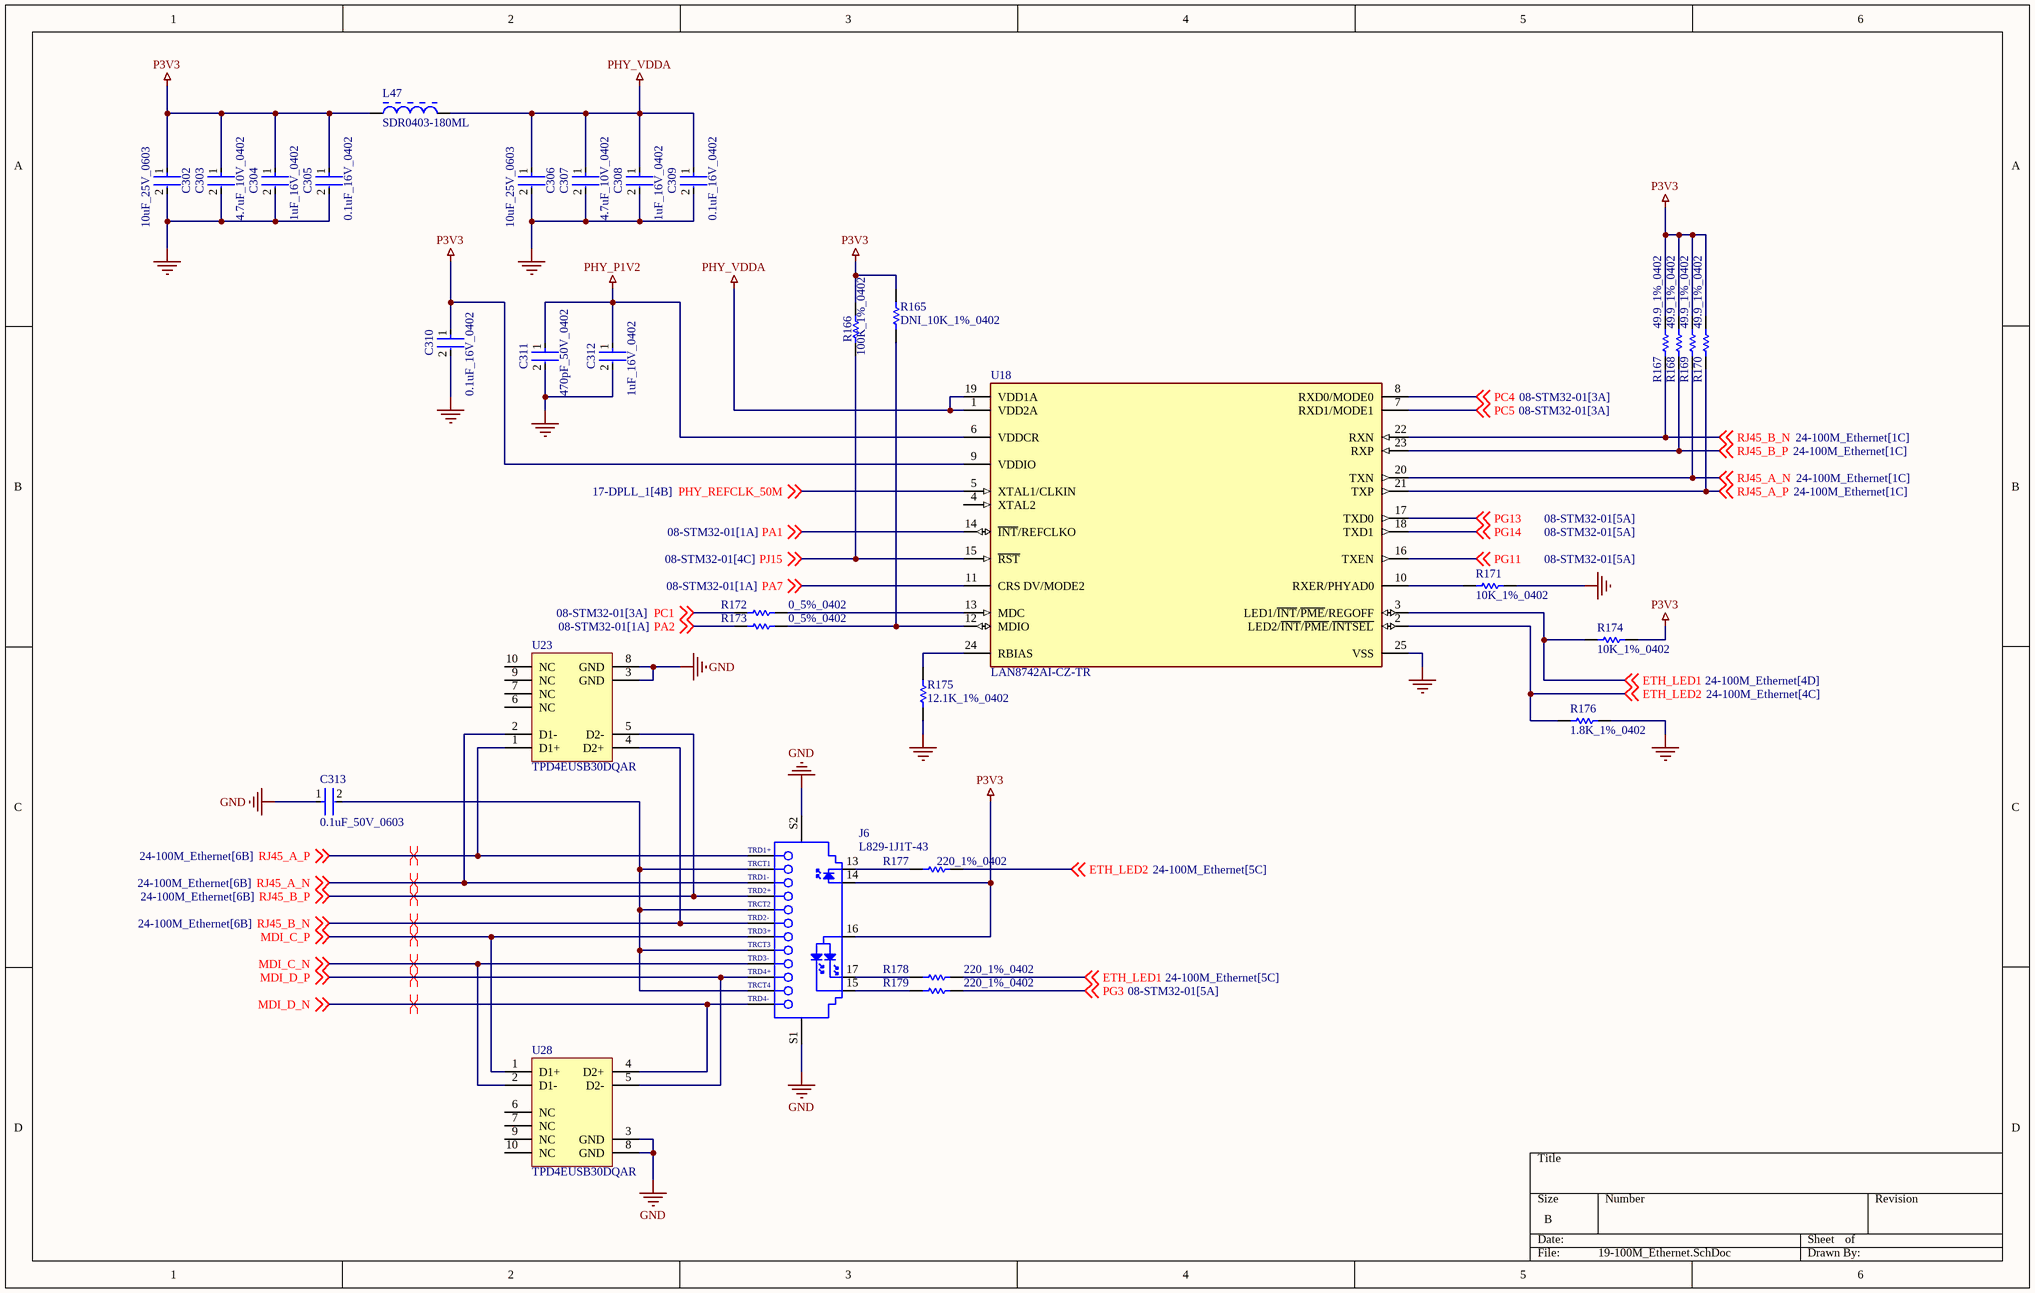
[diagram p15: 19-100M_Ethernet.SchDoc]

### Parts
C302  10uF_25V_0603  [FP-CL10-IPC_C]
C303  4.7uF_10V_0402  [FP-C1005-050-0_15-MFG]
C304  1uF_16V_0402  [FP-0402-L_1_0_0_05-W_0_5-IPC_A]
C305  0.1uF_16V_0402  [FP-C0402-BB-MFG]
C306  10uF_25V_0603  [FP-CL10-IPC_C]
C307  4.7uF_10V_0402  [FP-C1005-050-0_15-MFG]
C308  1uF_16V_0402  [FP-0402-L_1_0_0_05-W_0_5-IPC_A]
C309  0.1uF_16V_0402  [FP-C0402-BB-MFG]
C310  0.1uF_16V_0402  [FP-C0402-BB-MFG]
C311  470pF_50V_0402  [FP-GRM155-0_05-IPC_A]
C312  1uF_16V_0402  [FP-0402-L_1_0_0_05-W_0_5-IPC_A]
C313  0.1uF_50V_0603  [FP-C0603-CJ-MFG]
J6  L829-1J1T-43  [BELS-L829-1J1T-43_V]
L47  SDR0403-180ML  [BOUR-SDR0403-2_V]
R165  DNI_10K_1%_0402  [RESC1005X40X25NL10T10]  (no BOM)
R166  100K_1%_0402  [RESC1005X40X25ML05T10]
R167  49.9_1%_0402  [RESC1005X40X25NL10T10]
R168  49.9_1%_0402  [RESC1005X40X25NL10T10]
R169  49.9_1%_0402  [RESC1005X40X25NL10T10]
R170  49.9_1%_0402  [RESC1005X40X25NL10T10]
R171  10K_1%_0402  [RESC1005X40X25NL10T10]
R172  0_5%_0402  [RESC1005X40X25NL05T10]
R173  0_5%_0402  [RESC1005X40X25NL05T10]
R174  10K_1%_0402  [RESC1005X40X25NL10T10]
R175  12.1K_1%_0402  [RESC1005X40X25ML05T10]
R176  1.8K_1%_0402  [RESC1005X40X25LL05T05]
R177  220_1%_0402  [RESC1005X40X25LL10T10]
R178  220_1%_0402  [RESC1005X40X25LL10T10]
R179  220_1%_0402  [RESC1005X40X25LL10T10]
U18  LAN8742AI-CZ-TR  [FP-C04-143-MFG]
U23  TPD4EUSB30DQAR  [DQA0010A_V]
U28  TPD4EUSB30DQAR  [DQA0010A_V]

### Nets
GND: C302.2 C303.2 C304.2 C305.2 C306.2 C307.2 C308.2 C309.2 C310.2 C311.2 C312.2 C313.1 J6.S1 J6.S2 R171.1 R175.1 R176.2 U18.25(VSS) U23.3(GND) U23.8(GND) U28.3(GND) U28.8(GND)
P3V3: C302.1 C303.1 C304.1 C305.1 C310.1 J6.14 J6.16 L47.1 R165.1 R166.2 R167.1 R168.1 R169.1 R170.1 R174.1 U18.9(VDDIO)
PHY_P1V2: C311.1 C312.1 U18.6(VDDCR)
PHY_VDDA: C306.1 C307.1 C308.1 C309.1 L47.2 U18.1(VDD2A) U18.19(VDD1A)
ETH_LED1: R174.2 R178.2 U18.3(LED1/~{INT}/~{PME}/REGOFF) ; off-sheet ETH_LED1
ETH_LED2: R176.1 R177.2 U18.2(LED2/~{INT}/~{PME}/~{INTSEL}) ; off-sheet ETH_LED2
MDI_C_N: J6.9(TRD3-) U28.2(D1-) ; off-sheet MDI_C_N
MDI_C_P: J6.7(TRD3+) U28.1(D1+) ; off-sheet MDI_C_P
MDI_D_N: J6.12(TRD4-) U28.4(D2+) ; off-sheet MDI_D_N
MDI_D_P: J6.10(TRD4+) U28.5(D2-) ; off-sheet MDI_D_P
PA1: U18.14(~{INT}/REFCLKO) ; off-sheet PA1
PA2: R173.1 ; off-sheet PA2
PA7: U18.11(CRS_DV/MODE2) ; off-sheet PA7
PC1: R172.1 ; off-sheet PC1
PC4: U18.8(RXD0/MODE0) ; off-sheet PC4
PC5: U18.7(RXD1/MODE1) ; off-sheet PC5
PG3: R179.2 ; off-sheet PG3
PG11: U18.16(TXEN) ; off-sheet PG11
PG13: U18.17(TXD0) ; off-sheet PG13
PG14: U18.18(TXD1) ; off-sheet PG14
PHY_REFCLK_50M: U18.5(XTAL1/CLKIN) ; off-sheet PHY_REFCLK_50M
PJ15: R166.1 U18.15(~{RST}) ; off-sheet PJ15
RJ45_A_N: J6.3(TRD1-) R169.2 U18.20(TXN) U23.2(D1-) ; off-sheet RJ45_A_N
RJ45_A_P: J6.1(TRD1+) R170.2 U18.21(TXP) U23.1(D1+) ; off-sheet RJ45_A_P
RJ45_B_N: J6.6(TRD2-) R167.2 U18.22(RXN) U23.4(D2+) ; off-sheet RJ45_B_N
RJ45_B_P: J6.4(TRD2+) R168.2 U18.23(RXP) U23.5(D2-) ; off-sheet RJ45_B_P
NetC313_2: C313.2 J6.2(TRCT1) J6.5(TRCT2) J6.8(TRCT3) J6.11(TRCT4)
NetJ6_13: J6.13 R177.1
NetJ6_15: J6.15 R179.1
NetJ6_17: J6.17 R178.1
NetR165_2: R165.2 R173.2 U18.12(MDIO)
NetR171_2: R171.2 U18.10(RXER/PHYAD0)
NetR172_2: R172.2 U18.13(MDC)
NetR175_2: R175.2 U18.24(RBIAS)

Not connected (* = marked no-connect by the designer): U18 4(XTAL2); U23 6(NC) 7(NC) 9(NC) 10(NC); U28 6(NC) 7(NC) 9(NC) 10(NC)

### Layout directives
differential pair: MDI_C_N, MDI_C_P, MDI_D_N, MDI_D_P, RJ45_A_N, RJ45_A_P, RJ45_B_N, RJ45_B_P

### Library data of the parts
C302 C306 = CMP-13271-004224-1: Cap Ceramic 10uF 25V X5R ±20% Pad SMD 0603 +85°C T/R; Width: 0.031inch; Voltage Rating: 25V; Length: 0.063inch; Case Code (Metric): 1608; Dielectric: X5R; Termination: Wraparound; Capacitance: 10uF; Lead Free: Lead Free; Mount: Surface Mount; Package Quantity: 1; Case Code (Imperial): 0603; Thickness: 0.035inch; Packaging: Tape and Reel; Contact Plating: Tin; Min Operating Temperature: -55°C; Tolerance: 20%; Max Operating Temperature: 85°C; Case/Package: 0603
C303 C307 = CMP-2000-05997-2: CAP CER 4.7UF 10V X5R 0402; Dielectric Material: Ceramic; Tolerance: 10%; Series: C; Package Quantity: 10000; Max Operating Temperature: 85°C; Case Code (Imperial): 0402; Lead Free: Lead Free; Voltage Rating (DC): 10V; Packaging: Cut Tape; Voltage Rating: 10V; Min Operating Temperature: -55°C; Dielectric: X5R; Thickness: 0.022inch; Width: 0.02inch; Case/Package: 0402; Case Code (Metric): 1005; Capacitance: 4.7uF; Length: 0.039inch; RoHS Compliant: Yes; REACH SVHC: No SVHC; Mount: Surface Mount
C304 C308 C312 = CMP-14477-000104-2: None; Tolerance: 10%; Voltage Rating: 16V; Dielectric: X5R; Capacitance: 1uF; Packaging: Tape and Reel; Depth: 0.5mm; Mount: Surface Mount; Thickness: 0.022inch; Package Quantity: 1; Min Operating Temperature: -55°C; Series: M; Voltage Rating (DC): 16V; Termination: SMD/SMT; Case/Package: 0402; Number of Pins: 2; Case Code (Imperial): 0402; Length: 1mm; Halogen Free: Halogen Free; Case Code (Metric): 1005; Width: 0.02inch; RoHS Compliant: Yes; Radiation Hardening: No; Max Operating Temperature: 85°C; Height: 0.5mm; Construction: Flat
C305 C309 C310 = CMP-1034-02068-3: CAP CER 0.1UF 16V 5% X7R 0402; Manufacturer: Kemet; Manufacturer Part Number: C0402C104J4RACTU; Value: 0.10 μF; Temperature Coefficient: 15%; Tolerance: 0.05; Material: Ceramic; ComponentLink2URL: https://content.kemet.com/datasheets/KEM_C1002_X7R_SMD.pdf; Automotive: No; Device Class L2: Capacitors; Temperature: -55°C to +125°C; RoHS: TRUE; Voltage Rating: 16 V; ComponentLink2Description: Datasheet; Device Class L3: Ceramic Capacitors; Temperature Range Low: -55°C; Ipc Land Pattern Name: CAPC10050X50; Device Class L1: Passive Components; Temperature Range High: +125°C; Package: C0402-BB; Capacitance: 0.10 μF; Category: Cap; Mouser Description: CAP CER 0.1UF 16V X7R 0402; Height: 0.55mm; Digikey Description: CAP CER 0.1UF 16V 5% X7R 0402; Octopart: https://octopart.com/c0402c104j4ractu-kemet-12573893; Temperature Characteristic: X7R; Lead Free: Yes
C311 = CMP-2008-04369-2: Chip Multilayer Ceramic Capacitors for General Purpose, 0402, 470pF, C0G, 30ppm/°C, 5%, 50V; Insulation Resistance: 10GR; Depth: 0.5mm; Voltage Rating: 50V; Packaging: Tape and Reel; Material: Ceramic; Lead Free: Lead Free; Max Operating Temperature: 125°C; Length: 1mm; Min Operating Temperature: -55°C; Height: 0.5mm; Width: 0.5mm; Thickness: 0.022inch; Voltage: 50V; Termination: SMD/SMT; Dielectric Material: Ceramic; REACH SVHC: No SVHC; Voltage Rating (DC): 50V; Package Quantity: 1; Dielectric: C0G; Radiation Hardening: No; Mount: Surface Mount; Case/Package: 0402; Number of Pins: 2; Tolerance: 5%; Temperature Coefficient: 30ppm/°C; Case Code (Metric): 1005; Capacitance: 470pF; Case Code (Imperial): 0402
C313 = CMP-2006-03300-2: CAP CER 0.1UF 50V X7R 0603; Manufacturer Part Number: C0603X104K5RACTU; Manufacturer: Kemet; Capacitance: 100nF; Material: Ceramic; Tolerance: 10%; Value: 100nF; Temperature Coefficient: 15%; Temperature Range High: +125°C; Temperature Range Low: -55°C; Voltage: 50V; ComponentLink2Description: Datasheet; RoHS: TRUE; ComponentLink2URL: https://content.kemet.com/datasheets/KEM_C1013_X7R_FT-CAP_SMD.pdf; Device Class L3: Ceramic Capacitors; Device Class L2: Capacitors; Package: C0603-CJ; Height: 0.95mm; Device Class L1: Passive Components; Temperature Characteristic: X7R; Lead Free: Yes; Digikey Description: CAP CER 0.1UF 50V X7R 0603; Automotive: No; Mouser Description: Capacitor; Ceramic; Cap 0.1uF; Tol+10%; SMT; Flexible Termination; Vol-Rtg 50V; TR; Temperature: -55°C to +125°C; Octopart: https://octopart.com/c0603x104k5ractu-kemet-9145062; Category: Cap; Voltage Rating: 50V; Ipc Land Pattern Name: CAPC16080X80
J6 = CMP-1715-00001-1: Gigabit MagJack(R) Ultra Low Profile, 10/100/1000 Base-T, 19-Pin THD, RoHS, Tray; Width: 24.13 mm; RoHSCompliant: True; PartNumber: L829-1J1T-43; Case/Package: Metal; Mount: Through Hole; ComponentLink1Description: Manufacturer URL; Height: 11.3 mm; Package Quantity: 60; Packaging: Tray; Length: 17.78 mm; PackageDescription: 19-Pin Through Hole Device, Body 23.94 x 17.58 mm, Pitch 2.03 mm; ComponentLink2URL: http://belfuse.com/pdfs/L829-1J1T-43.pdf; ComponentLink1URL: http://belfuse.com/ethernet/; Mounting Technology: Through Hole; DatasheetVersion: Rev. G; Pins: 8; ComponentLink2Description: Datasheet
L47 = CMP-0904-00005-1: SDR0403 Series Power Inductor, 18 uF +/- 20 %, 0.34 Ohm, -40 to 125 degC, 2-Pin SMD, RoHS, Tape and Reel; Manufacturer: Bourns; Tolerance (%): +/- 20; I rms (A): 0.84 Max.; Q: 25; I sat (A): 1.3 Typ.; Test Frequency (MHz): 2.52; Inductance (uH): 18; SRF (MHz): 23 Min.; RDC (Ohm): 0.34 Max.; PackageReference: SDR0403-2; ComponentLink1URL: http://www.bourns.com/; RoHS: TRUE; PartNumber: SDR0403-180ML; ComponentLink2Description: Datasheet; Packing: Tape and Reel; Temperature Range: -40 to 125 degC; Mounting Technology: Surface Mount; DatasheetVersion: Feb-12; PackageDescription: 3-Pin SMD, Dia 4.5 mm, Height 3.5 mm; ComponentLink2URL: http://www.bourns.com/data/global/pdfs/sdr0403.pdf; ComponentLink1Description: Manufacturer URL
R165 R171 R174 = CMP-2002-04694-1: Manufacturer: Bourns; Part Number: CR0402-FX-1002GLF
R166 = CMP-2002-07852-1: Manufacturer: Yageo; Part Number: RC0402FR-13100KL
R167-R170 = CMP-2002-04448-1: Part Number: RK73H1ETTP49R9F; Manufacturer: KOA Speer
R172 R173 = CMP-2002-06457-1: Manufacturer: Panasonic; Part Number: ERJ-U020R00X
R175 = CMP-2002-07375-1: Part Number: RC0402FR-0712K1L; Manufacturer: Yageo / Phycomp
R176 = CMP-2002-01128-1: Manufacturer: Panasonic; Part Number: ERJ2RKF1801X
R177-R179 = CMP-2002-03891-1: Part Number: RK73H1ETTP2200F; Manufacturer: KOA Speer
U18 = CMP-06281-000002-1: IC TRANSCEIVER FULL 1/1 24SQFN; Manufacturer: Microchip; Simplex Duplex: Full Duplex; Max Supply Voltage: 3.6V; Standoff Height: 0mm; Number Of Channels: 1; Data Rate: 100Mbits/s; Interface: Ethernet,Other; Min Supply Voltage: 1.14V; Ambient Temperature Range Low: -40°C; Height: 1mm; Digikey Description: IC TRANSCEIVER FULL 1/1 24SQFN; Lead Free: Yes; Category: IC; Temperature Range Low: -40°C; Temperature: -40°C to +85°C; RoHS: TRUE; ComponentLink2URL: http://ww1.microchip.com/downloads/en/DeviceDoc/DS_LAN8742_00001989A.pdf; Package: C04-143; Mouser Description: Small Footprint RMII 10/100 Ethernet Transceiver with flexPWR Technology; Device Class L1: Integrated Circuits (ICs); Temperature Range High: +85°C; Device Class L2: Interface ICs; ComponentLink2Description: Datasheet; Manufacturer Part Number: LAN8742AI-CZ-TR; Device Class L3: Ethernet Interface ICs; Ambient Temperature Range High: +85°C; Ipc Land Pattern Name: QFN50P400X400X90-24; Octopart: https://octopart.com/lan8742ai-cz-tr-microchip-29030589; Automotive: No
U23 U28 = CMP-0326-00027-3: ESD Solution for Super-Speed (6 GBPS) USB 3.0 Interface, 4 Channels, -40 to +85 degC, 10-pin SON (DQA), Green (RoHS & no Sb/Br); Manufacturer: Texas Instruments; Differential Capacitance(pF): 0.05; Serial ATA / eSATA: TRUE; IO Capacitance(Typ)(pF): 0.8; IO Leakage Current(nA): 10; IEC 61000-4-2 Air-Gap(+/- kV): 8; ComponentLink3Description: URL Link1; PartNumber: TPD4EUSB30DQAR; DatasheetVersion: SLVSAC2C; ComponentLink2URL: http://www.ti.com/general/docs/lit/getliterature.tsp?genericPartNumber=TPD4EUSB30&fileType=pdf; USB Super Speed: TRUE; Eco-Plan: Green (RoHS & no Sb/Br); Mounting Technology: Surface Mount; 1394 / Firewire: TRUE; PackageVersion: revB, Sep-2009; SubFamily: ESD Solution; USB Full Speed: TRUE; USB High Speed: TRUE; ComponentLink2Description: Datasheet; ComponentLink1URL: http://www.ti.com/; IEC 61000-4-2 Contact(+/- kV): 8; Breakdown Voltage(Min)(V): 8; PackageReference: DQA0010A; ComponentLink1Description: Manufacturer URL; PackageDescription: 10-Pin Plastic Small Outline No-Lead, 1 x 2.5 x 0.55 mm Body, 0.5 mm Pitch; ComponentLink3URL: SamplesURL:http://www.ti.com/product/tpd4eusb30#samples; HDMI: TRUE